# EAGLE design TicTacToe_v3 (EAGLE 9.6.2)

## Sheet 1 of 4
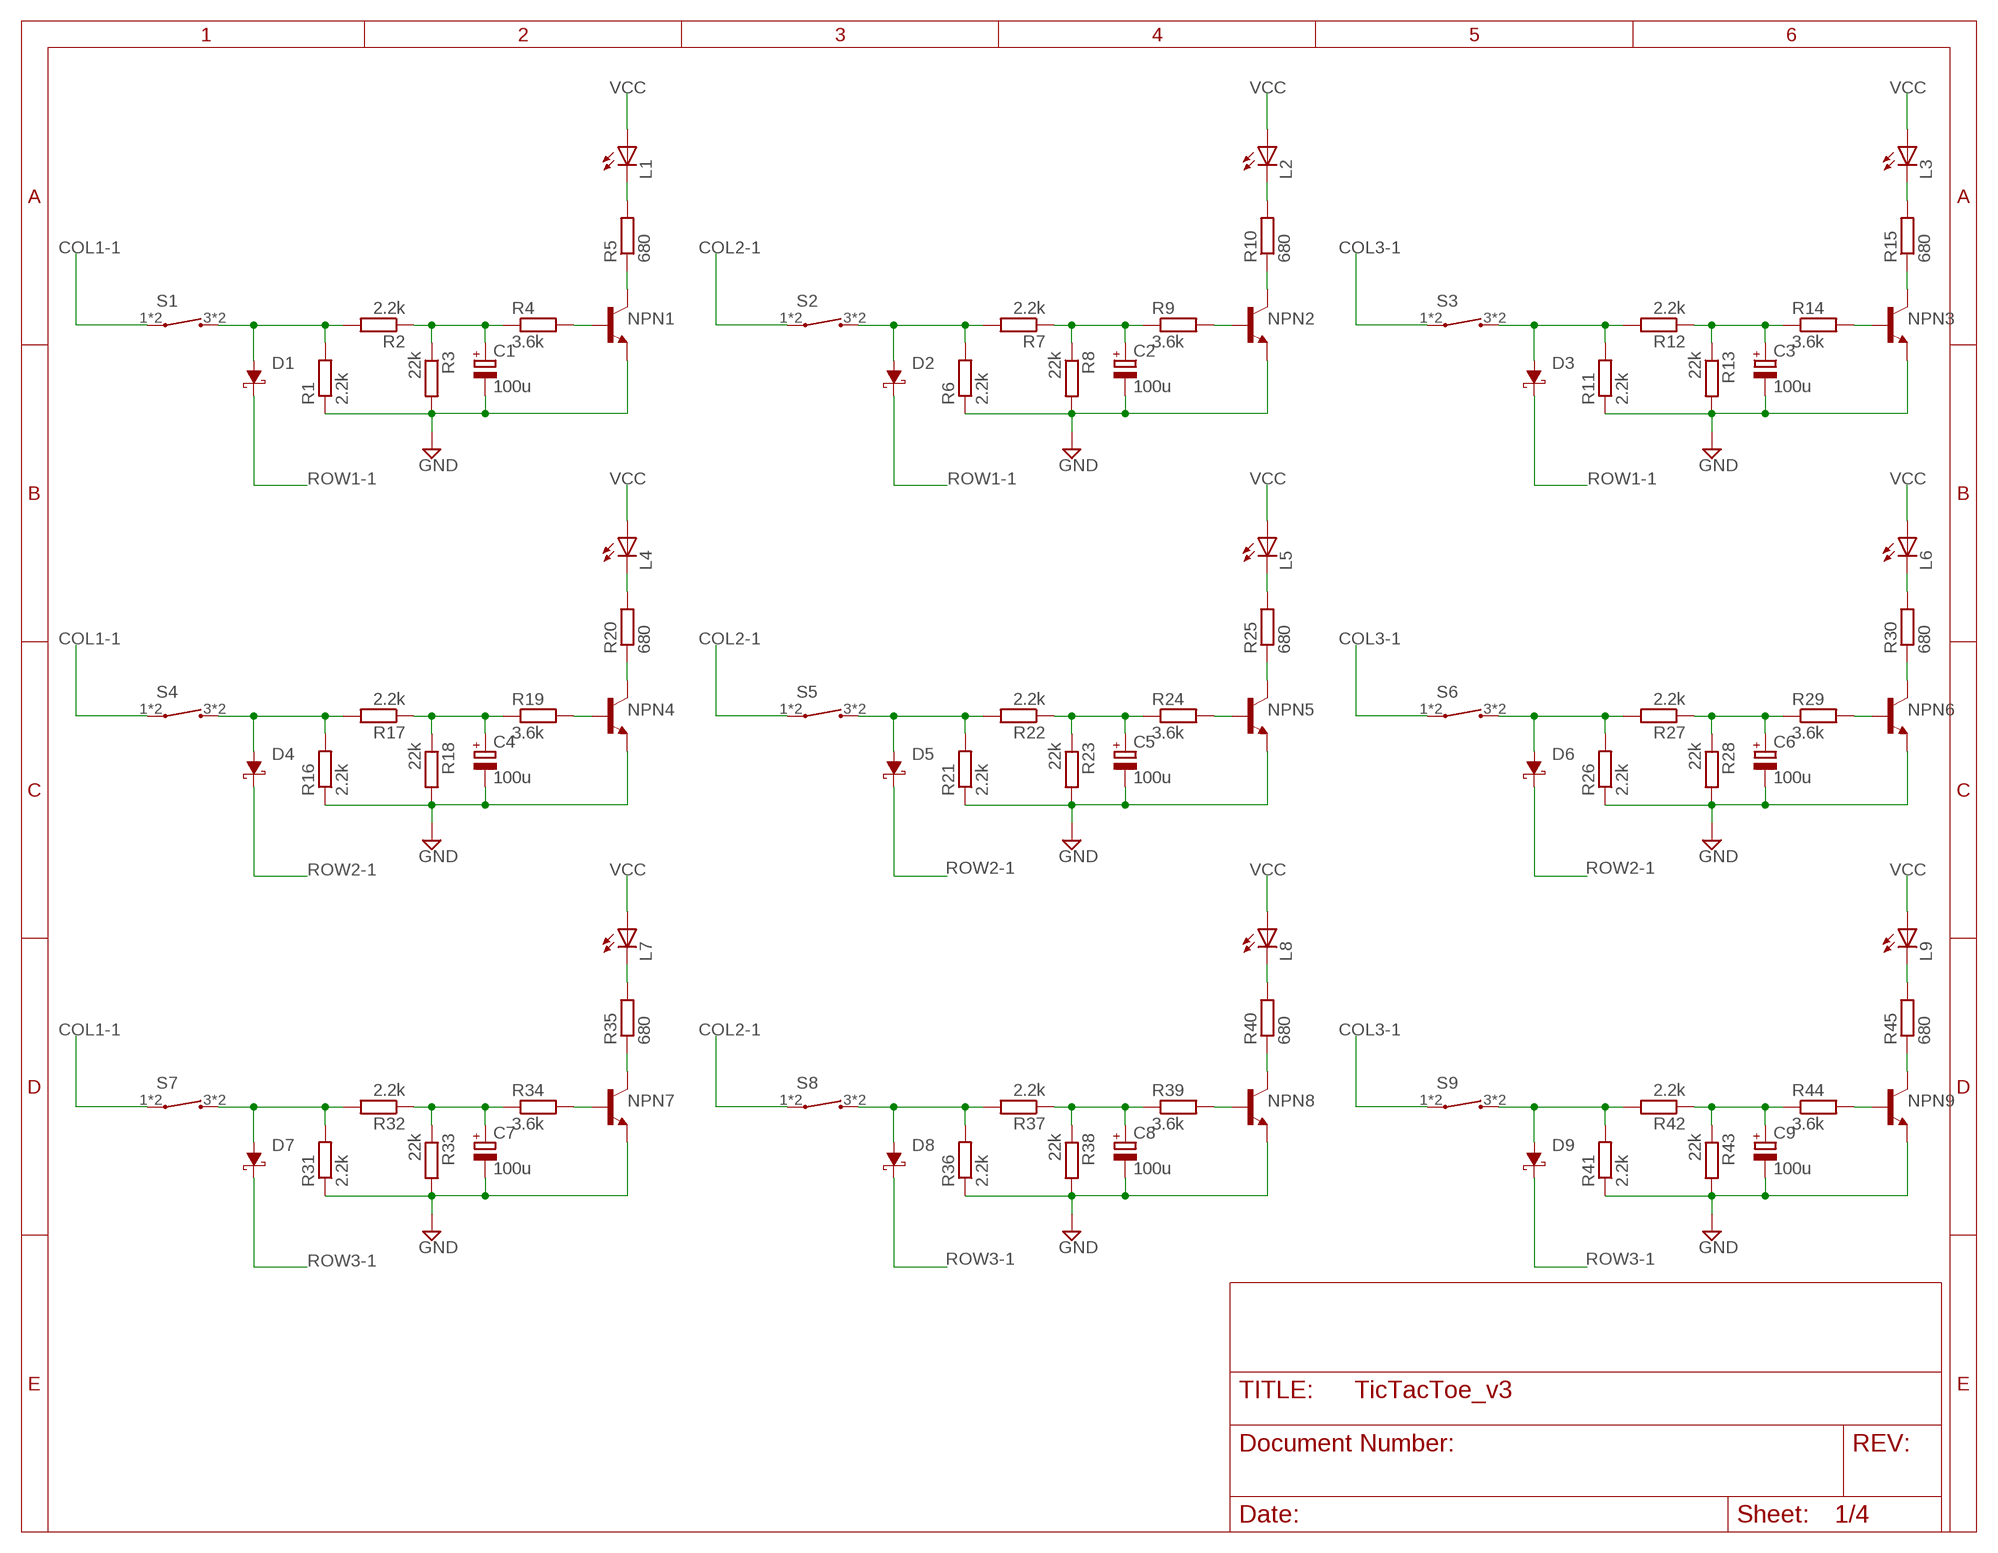
[diagram p0: schematic, sheet 1]

### Parts
C1  100u  T490A  [T490A-COND]
C2  100u  T490A  [T490A-COND]
C3  100u  T490A  [T490A-COND]
C4  100u  T490A  [T490A-COND]
C5  100u  T490A  [T490A-COND]
C6  100u  T490A  [T490A-COND]
C7  100u  T490A  [T490A-COND]
C8  100u  T490A  [T490A-COND]
C9  100u  T490A  [T490A-COND]
D1  PMEG3010EH  [PMEG3010EH-SCHOTTKYDIODE]
D2  PMEG3010EH  [PMEG3010EH-SCHOTTKYDIODE]
D3  PMEG3010EH  [PMEG3010EH-SCHOTTKYDIODE]
D4  PMEG3010EH  [PMEG3010EH-SCHOTTKYDIODE]
D5  PMEG3010EH  [PMEG3010EH-SCHOTTKYDIODE]
D6  PMEG3010EH  [PMEG3010EH-SCHOTTKYDIODE]
D7  PMEG3010EH  [PMEG3010EH-SCHOTTKYDIODE]
D8  PMEG3010EH  [PMEG3010EH-SCHOTTKYDIODE]
D9  PMEG3010EH  [PMEG3010EH-SCHOTTKYDIODE]
L1  150060BS75003  [WL-SMCW-LED(BLUE)]
L2  150060BS75003  [WL-SMCW-LED(BLUE)]
L3  150060BS75003  [WL-SMCW-LED(BLUE)]
L4  150060BS75003  [WL-SMCW-LED(BLUE)]
L5  150060BS75003  [WL-SMCW-LED(BLUE)]
L6  150060BS75003  [WL-SMCW-LED(BLUE)]
L7  150060BS75003  [WL-SMCW-LED(BLUE)]
L8  150060BS75003  [WL-SMCW-LED(BLUE)]
L9  150060BS75003  [WL-SMCW-LED(BLUE)]
NPN1  BC848  [BC848-NPN]
NPN2  BC848  [BC848-NPN]
NPN3  BC848  [BC848-NPN]
NPN4  BC848  [BC848-NPN]
NPN5  BC848  [BC848-NPN]
NPN6  BC848  [BC848-NPN]
NPN7  BC848  [BC848-NPN]
NPN8  BC848  [BC848-NPN]
NPN9  BC848  [BC848-NPN]
R1  2.2k  R-EU_R0603  [R0603]
R2  2.2k  R-EU_R0603  [R0603]
R3  22k  R-EU_R0603  [R0603]
R4  3.6k  R-EU_R0603  [R0603]
R5  680  R-EU_R0603  [R0603]
R6  2.2k  R-EU_R0603  [R0603]
R7  2.2k  R-EU_R0603  [R0603]
R8  22k  R-EU_R0603  [R0603]
R9  3.6k  R-EU_R0603  [R0603]
R10  680  R-EU_R0603  [R0603]
R11  2.2k  R-EU_R0603  [R0603]
R12  2.2k  R-EU_R0603  [R0603]
R13  22k  R-EU_R0603  [R0603]
R14  3.6k  R-EU_R0603  [R0603]
R15  680  R-EU_R0603  [R0603]
R16  2.2k  R-EU_R0603  [R0603]
R17  2.2k  R-EU_R0603  [R0603]
R18  22k  R-EU_R0603  [R0603]
R19  3.6k  R-EU_R0603  [R0603]
R20  680  R-EU_R0603  [R0603]
R21  2.2k  R-EU_R0603  [R0603]
R22  2.2k  R-EU_R0603  [R0603]
R23  22k  R-EU_R0603  [R0603]
R24  3.6k  R-EU_R0603  [R0603]
R25  680  R-EU_R0603  [R0603]
R26  2.2k  R-EU_R0603  [R0603]
R27  2.2k  R-EU_R0603  [R0603]
R28  22k  R-EU_R0603  [R0603]
R29  3.6k  R-EU_R0603  [R0603]
R30  680  R-EU_R0603  [R0603]
R31  2.2k  R-EU_R0603  [R0603]
R32  2.2k  R-EU_R0603  [R0603]
R33  22k  R-EU_R0603  [R0603]
R34  3.6k  R-EU_R0603  [R0603]
R35  680  R-EU_R0603  [R0603]
R36  2.2k  R-EU_R0603  [R0603]
R37  2.2k  R-EU_R0603  [R0603]
R38  22k  R-EU_R0603  [R0603]
R39  3.6k  R-EU_R0603  [R0603]
R40  680  R-EU_R0603  [R0603]
R41  2.2k  R-EU_R0603  [R0603]
R42  2.2k  R-EU_R0603  [R0603]
R43  22k  R-EU_R0603  [R0603]
R44  3.6k  R-EU_R0603  [R0603]
R45  680  R-EU_R0603  [R0603]
S1  PTS647  [PTS647-TACTSWITCH]
S2  PTS647  [PTS647-TACTSWITCH]
S3  PTS647  [PTS647-TACTSWITCH]
S4  PTS647  [PTS647-TACTSWITCH]
S5  PTS647  [PTS647-TACTSWITCH]
S6  PTS647  [PTS647-TACTSWITCH]
S7  PTS647  [PTS647-TACTSWITCH]
S8  PTS647  [PTS647-TACTSWITCH]
S9  PTS647  [PTS647-TACTSWITCH]

### Nets
COL1-1: S1.1 S1.2 S4.1 S4.2 S7.1 S7.2 ; also sheet 4
COL2-1: S2.1 S2.2 S5.1 S5.2 S8.1 S8.2 ; also sheet 4
COL3-1: S3.1 S3.2 S6.1 S6.2 S9.1 S9.2 ; also sheet 4
GND: C1.2(-) C2.2(-) C3.2(-) C4.2(-) C5.2(-) C6.2(-) C7.2(-) C8.2(-) C9.2(-) NPN1.2(E) NPN2.2(E) NPN3.2(E) NPN4.2(E) NPN5.2(E) NPN6.2(E) NPN7.2(E) NPN8.2(E) NPN9.2(E) R1.1 R3.2 R6.1 R8.2 R11.1 R13.2 R16.1 R18.2 R21.1 R23.2 R26.1 R28.2 R31.1 R33.2 R36.1 R38.2 R41.1 R43.2 ; also sheet 2,4
N$1: D1.2(A) R1.2 R2.2 S1.3 S1.4
N$2: C1.1(+) R2.1 R3.1 R4.1
N$3: NPN1.1(B) R4.2
N$4: D2.2(A) R6.2 R7.2 S2.3 S2.4
N$5: C2.1(+) R7.1 R8.1 R9.1
N$6: NPN1.3(C) R5.1
N$7: L1.1(C) R5.2
N$8: NPN2.1(B) R9.2
N$9: D4.2(A) R16.2 R17.2 S4.3 S4.4
N$10: NPN2.3(C) R10.1
N$11: L2.1(C) R10.2
N$12: C4.1(+) R17.1 R18.1 R19.1
N$13: D3.2(A) R11.2 R12.2 S3.3 S3.4
N$14: C3.1(+) R12.1 R13.1 R14.1
N$15: NPN3.1(B) R14.2
N$16: NPN3.3(C) R15.1
N$17: L3.1(C) R15.2
N$18: NPN4.1(B) R19.2
N$19: NPN4.3(C) R20.1
N$20: L4.1(C) R20.2
N$21: D5.2(A) R21.2 R22.2 S5.3 S5.4
N$22: C5.1(+) R22.1 R23.1 R24.1
N$23: NPN5.1(B) R24.2
N$24: NPN5.3(C) R25.1
N$25: L5.1(C) R25.2
N$26: D6.2(A) R26.2 R27.2 S6.3 S6.4
N$27: C6.1(+) R27.1 R28.1 R29.1
N$28: NPN6.1(B) R29.2
N$29: NPN6.3(C) R30.1
N$30: L6.1(C) R30.2
N$31: D7.2(A) R31.2 R32.2 S7.3 S7.4
N$32: C7.1(+) R32.1 R33.1 R34.1
N$33: NPN7.1(B) R34.2
N$34: NPN7.3(C) R35.1
N$35: L7.1(C) R35.2
N$36: D8.2(A) R36.2 R37.2 S8.3 S8.4
N$37: C8.1(+) R37.1 R38.1 R39.1
N$38: NPN8.1(B) R39.2
N$39: NPN8.3(C) R40.1
N$40: L8.1(C) R40.2
N$41: D9.2(A) R41.2 R42.2 S9.3 S9.4
N$42: C9.1(+) R42.1 R43.1 R44.1
N$43: NPN9.1(B) R44.2
N$44: NPN9.3(C) R45.1
N$45: L9.1(C) R45.2
ROW1-1: D1.1(C) D2.1(C) D3.1(C) ; also sheet 4
ROW2-1: D4.1(C) D5.1(C) D6.1(C) ; also sheet 4
ROW3-1: D7.1(C) D8.1(C) D9.1(C) ; also sheet 4
VCC: L1.2(A) L2.2(A) L3.2(A) L4.2(A) L5.2(A) L6.2(A) L7.2(A) L8.2(A) L9.2(A) ; also sheet 2,4

## Sheet 2 of 4
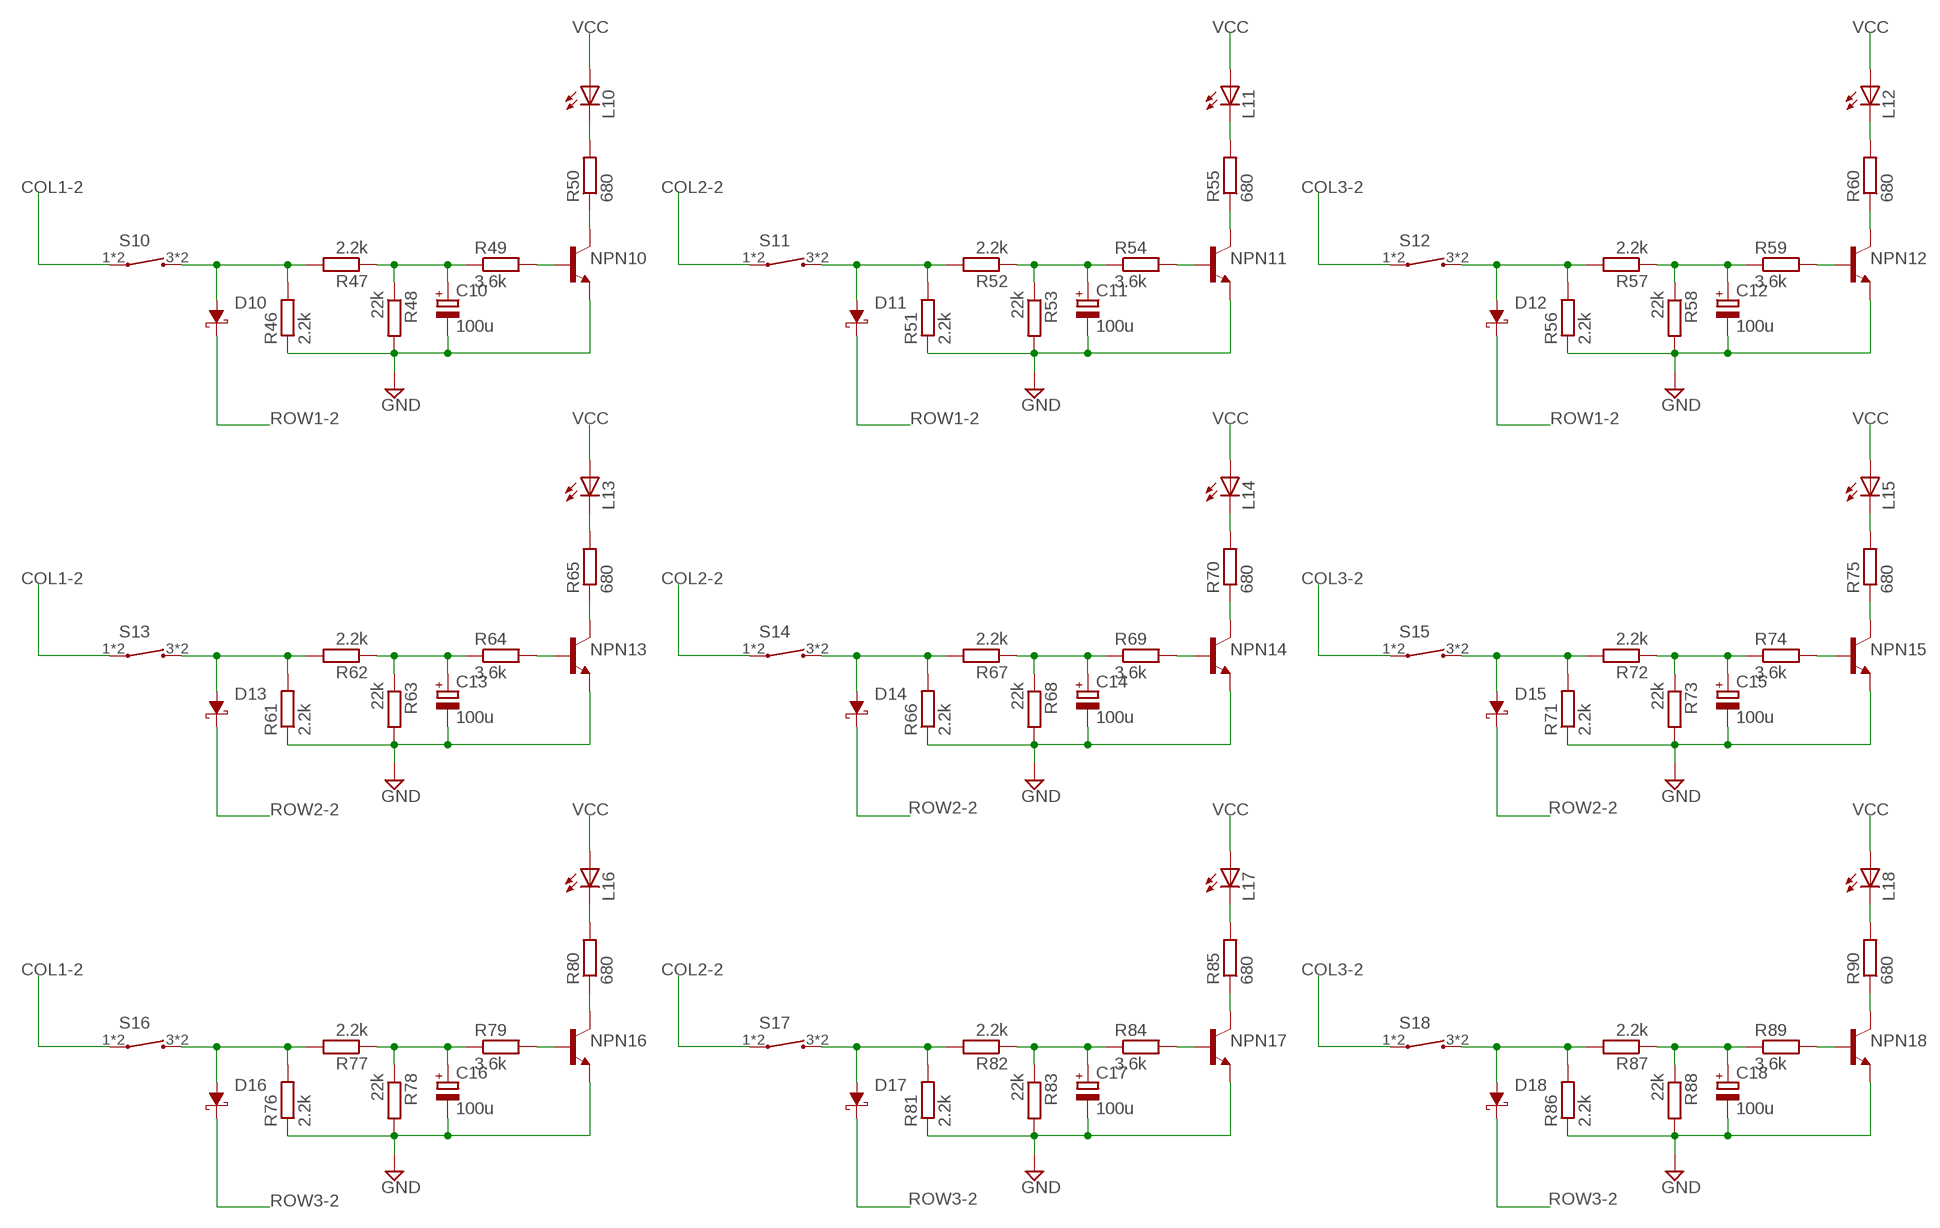
[diagram p1: schematic, sheet 2]

### Parts
C10  100u  T490A  [T490A-COND]
C11  100u  T490A  [T490A-COND]
C12  100u  T490A  [T490A-COND]
C13  100u  T490A  [T490A-COND]
C14  100u  T490A  [T490A-COND]
C15  100u  T490A  [T490A-COND]
C16  100u  T490A  [T490A-COND]
C17  100u  T490A  [T490A-COND]
C18  100u  T490A  [T490A-COND]
D10  PMEG3010EH  [PMEG3010EH-SCHOTTKYDIODE]
D11  PMEG3010EH  [PMEG3010EH-SCHOTTKYDIODE]
D12  PMEG3010EH  [PMEG3010EH-SCHOTTKYDIODE]
D13  PMEG3010EH  [PMEG3010EH-SCHOTTKYDIODE]
D14  PMEG3010EH  [PMEG3010EH-SCHOTTKYDIODE]
D15  PMEG3010EH  [PMEG3010EH-SCHOTTKYDIODE]
D16  PMEG3010EH  [PMEG3010EH-SCHOTTKYDIODE]
D17  PMEG3010EH  [PMEG3010EH-SCHOTTKYDIODE]
D18  PMEG3010EH  [PMEG3010EH-SCHOTTKYDIODE]
L10  150060BS75003  [WL-SMCW-LED(BLUE)]
L11  150060BS75003  [WL-SMCW-LED(BLUE)]
L12  150060BS75003  [WL-SMCW-LED(BLUE)]
L13  150060BS75003  [WL-SMCW-LED(BLUE)]
L14  150060BS75003  [WL-SMCW-LED(BLUE)]
L15  150060BS75003  [WL-SMCW-LED(BLUE)]
L16  150060BS75003  [WL-SMCW-LED(BLUE)]
L17  150060BS75003  [WL-SMCW-LED(BLUE)]
L18  150060BS75003  [WL-SMCW-LED(BLUE)]
NPN10  BC848  [BC848-NPN]
NPN11  BC848  [BC848-NPN]
NPN12  BC848  [BC848-NPN]
NPN13  BC848  [BC848-NPN]
NPN14  BC848  [BC848-NPN]
NPN15  BC848  [BC848-NPN]
NPN16  BC848  [BC848-NPN]
NPN17  BC848  [BC848-NPN]
NPN18  BC848  [BC848-NPN]
R46  2.2k  R-EU_R0603  [R0603]
R47  2.2k  R-EU_R0603  [R0603]
R48  22k  R-EU_R0603  [R0603]
R49  3.6k  R-EU_R0603  [R0603]
R50  680  R-EU_R0603  [R0603]
R51  2.2k  R-EU_R0603  [R0603]
R52  2.2k  R-EU_R0603  [R0603]
R53  22k  R-EU_R0603  [R0603]
R54  3.6k  R-EU_R0603  [R0603]
R55  680  R-EU_R0603  [R0603]
R56  2.2k  R-EU_R0603  [R0603]
R57  2.2k  R-EU_R0603  [R0603]
R58  22k  R-EU_R0603  [R0603]
R59  3.6k  R-EU_R0603  [R0603]
R60  680  R-EU_R0603  [R0603]
R61  2.2k  R-EU_R0603  [R0603]
R62  2.2k  R-EU_R0603  [R0603]
R63  22k  R-EU_R0603  [R0603]
R64  3.6k  R-EU_R0603  [R0603]
R65  680  R-EU_R0603  [R0603]
R66  2.2k  R-EU_R0603  [R0603]
R67  2.2k  R-EU_R0603  [R0603]
R68  22k  R-EU_R0603  [R0603]
R69  3.6k  R-EU_R0603  [R0603]
R70  680  R-EU_R0603  [R0603]
R71  2.2k  R-EU_R0603  [R0603]
R72  2.2k  R-EU_R0603  [R0603]
R73  22k  R-EU_R0603  [R0603]
R74  3.6k  R-EU_R0603  [R0603]
R75  680  R-EU_R0603  [R0603]
R76  2.2k  R-EU_R0603  [R0603]
R77  2.2k  R-EU_R0603  [R0603]
R78  22k  R-EU_R0603  [R0603]
R79  3.6k  R-EU_R0603  [R0603]
R80  680  R-EU_R0603  [R0603]
R81  2.2k  R-EU_R0603  [R0603]
R82  2.2k  R-EU_R0603  [R0603]
R83  22k  R-EU_R0603  [R0603]
R84  3.6k  R-EU_R0603  [R0603]
R85  680  R-EU_R0603  [R0603]
R86  2.2k  R-EU_R0603  [R0603]
R87  2.2k  R-EU_R0603  [R0603]
R88  22k  R-EU_R0603  [R0603]
R89  3.6k  R-EU_R0603  [R0603]
R90  680  R-EU_R0603  [R0603]
S10  PTS647  [PTS647-TACTSWITCH]
S11  PTS647  [PTS647-TACTSWITCH]
S12  PTS647  [PTS647-TACTSWITCH]
S13  PTS647  [PTS647-TACTSWITCH]
S14  PTS647  [PTS647-TACTSWITCH]
S15  PTS647  [PTS647-TACTSWITCH]
S16  PTS647  [PTS647-TACTSWITCH]
S17  PTS647  [PTS647-TACTSWITCH]
S18  PTS647  [PTS647-TACTSWITCH]

### Nets
COL1-2: S10.1 S10.2 S13.1 S13.2 S16.1 S16.2 ; also sheet 4
COL2-2: S11.1 S11.2 S14.1 S14.2 S17.1 S17.2 ; also sheet 4
COL3-2: S12.1 S12.2 S15.1 S15.2 S18.1 S18.2 ; also sheet 4
GND: C10.2(-) C11.2(-) C12.2(-) C13.2(-) C14.2(-) C15.2(-) C16.2(-) C17.2(-) C18.2(-) NPN10.2(E) NPN11.2(E) NPN12.2(E) NPN13.2(E) NPN14.2(E) NPN15.2(E) NPN16.2(E) NPN17.2(E) NPN18.2(E) R46.1 R48.2 R51.1 R53.2 R56.1 R58.2 R61.1 R63.2 R66.1 R68.2 R71.1 R73.2 R76.1 R78.2 R81.1 R83.2 R86.1 R88.2 ; also sheet 1,4
N$46: D10.2(A) R46.2 R47.2 S10.3 S10.4
N$47: C10.1(+) R47.1 R48.1 R49.1
N$48: NPN10.1(B) R49.2
N$49: NPN10.3(C) R50.1
N$50: L10.1(C) R50.2
N$51: D11.2(A) R51.2 R52.2 S11.3 S11.4
N$52: C11.1(+) R52.1 R53.1 R54.1
N$53: NPN11.1(B) R54.2
N$54: NPN11.3(C) R55.1
N$55: L11.1(C) R55.2
N$56: D12.2(A) R56.2 R57.2 S12.3 S12.4
N$57: C12.1(+) R57.1 R58.1 R59.1
N$58: NPN12.1(B) R59.2
N$59: NPN12.3(C) R60.1
N$60: L12.1(C) R60.2
N$61: D13.2(A) R61.2 R62.2 S13.3 S13.4
N$62: C13.1(+) R62.1 R63.1 R64.1
N$63: NPN13.1(B) R64.2
N$64: NPN13.3(C) R65.1
N$65: L13.1(C) R65.2
N$66: D14.2(A) R66.2 R67.2 S14.3 S14.4
N$67: C14.1(+) R67.1 R68.1 R69.1
N$68: NPN14.1(B) R69.2
N$69: NPN14.3(C) R70.1
N$70: L14.1(C) R70.2
N$71: D15.2(A) R71.2 R72.2 S15.3 S15.4
N$72: C15.1(+) R72.1 R73.1 R74.1
N$73: NPN15.1(B) R74.2
N$74: NPN15.3(C) R75.1
N$75: L15.1(C) R75.2
N$76: D16.2(A) R76.2 R77.2 S16.3 S16.4
N$77: C16.1(+) R77.1 R78.1 R79.1
N$78: NPN16.1(B) R79.2
N$79: NPN16.3(C) R80.1
N$80: L16.1(C) R80.2
N$81: D17.2(A) R81.2 R82.2 S17.3 S17.4
N$82: C17.1(+) R82.1 R83.1 R84.1
N$83: NPN17.1(B) R84.2
N$84: NPN17.3(C) R85.1
N$85: L17.1(C) R85.2
N$86: D18.2(A) R86.2 R87.2 S18.3 S18.4
N$87: C18.1(+) R87.1 R88.1 R89.1
N$88: NPN18.1(B) R89.2
N$89: NPN18.3(C) R90.1
N$90: L18.1(C) R90.2
ROW1-2: D10.1(C) D11.1(C) D12.1(C) ; also sheet 4
ROW2-2: D13.1(C) D14.1(C) D15.1(C) ; also sheet 4
ROW3-2: D16.1(C) D17.1(C) D18.1(C) ; also sheet 4
VCC: L10.2(A) L11.2(A) L12.2(A) L13.2(A) L14.2(A) L15.2(A) L16.2(A) L17.2(A) L18.2(A) ; also sheet 1,4

## Sheet 3 of 4
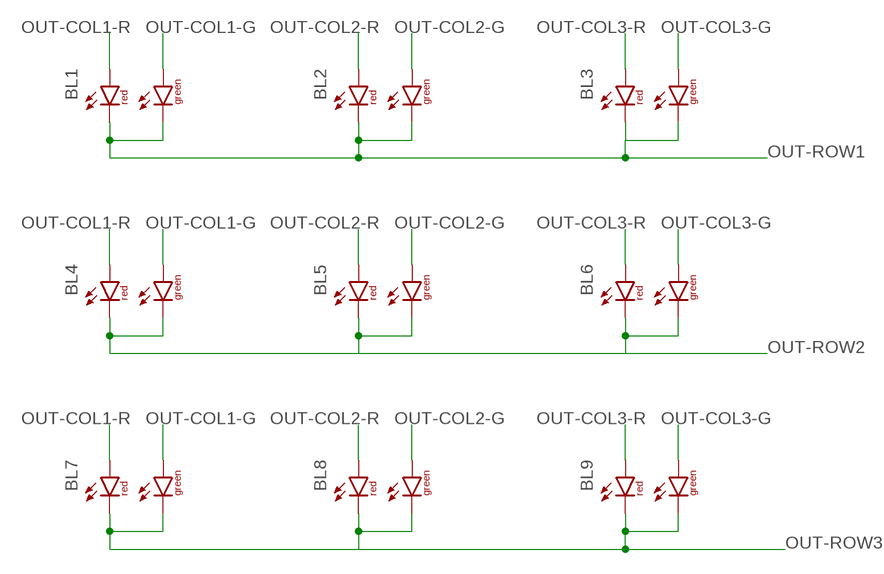
[diagram p2: schematic, sheet 3]

### Parts
BL1  APHBM2012ETSGT(R/G)  [APHBM2012ETSGTC-BICOLORLED(R/G)]
BL2  APHBM2012ETSGT(R/G)  [APHBM2012ETSGTC-BICOLORLED(R/G)]
BL3  APHBM2012ETSGT(R/G)  [APHBM2012ETSGTC-BICOLORLED(R/G)]
BL4  APHBM2012ETSGT(R/G)  [APHBM2012ETSGTC-BICOLORLED(R/G)]
BL5  APHBM2012ETSGT(R/G)  [APHBM2012ETSGTC-BICOLORLED(R/G)]
BL6  APHBM2012ETSGT(R/G)  [APHBM2012ETSGTC-BICOLORLED(R/G)]
BL7  APHBM2012ETSGT(R/G)  [APHBM2012ETSGTC-BICOLORLED(R/G)]
BL8  APHBM2012ETSGT(R/G)  [APHBM2012ETSGTC-BICOLORLED(R/G)]
BL9  APHBM2012ETSGT(R/G)  [APHBM2012ETSGTC-BICOLORLED(R/G)]

### Nets
OUT-COL1-G: BL1.4(AG) BL4.4(AG) BL7.4(AG) ; also sheet 4
OUT-COL1-R: BL1.1(AR) BL4.1(AR) BL7.1(AR) ; also sheet 4
OUT-COL2-G: BL2.4(AG) BL5.4(AG) BL8.4(AG) ; also sheet 4
OUT-COL2-R: BL2.1(AR) BL5.1(AR) BL8.1(AR) ; also sheet 4
OUT-COL3-G: BL3.4(AG) BL6.4(AG) BL9.4(AG) ; also sheet 4
OUT-COL3-R: BL3.1(AR) BL6.1(AR) BL9.1(AR) ; also sheet 4
OUT-ROW1: BL1.2(CR) BL1.3(CG) BL2.2(CR) BL2.3(CG) BL3.2(CR) BL3.3(CG) ; also sheet 4
OUT-ROW2: BL4.2(CR) BL4.3(CG) BL5.2(CR) BL5.3(CG) BL6.2(CR) BL6.3(CG) ; also sheet 4
OUT-ROW3: BL7.2(CR) BL7.3(CG) BL8.2(CR) BL8.3(CG) BL9.2(CR) BL9.3(CG) ; also sheet 4

## Sheet 4 of 4
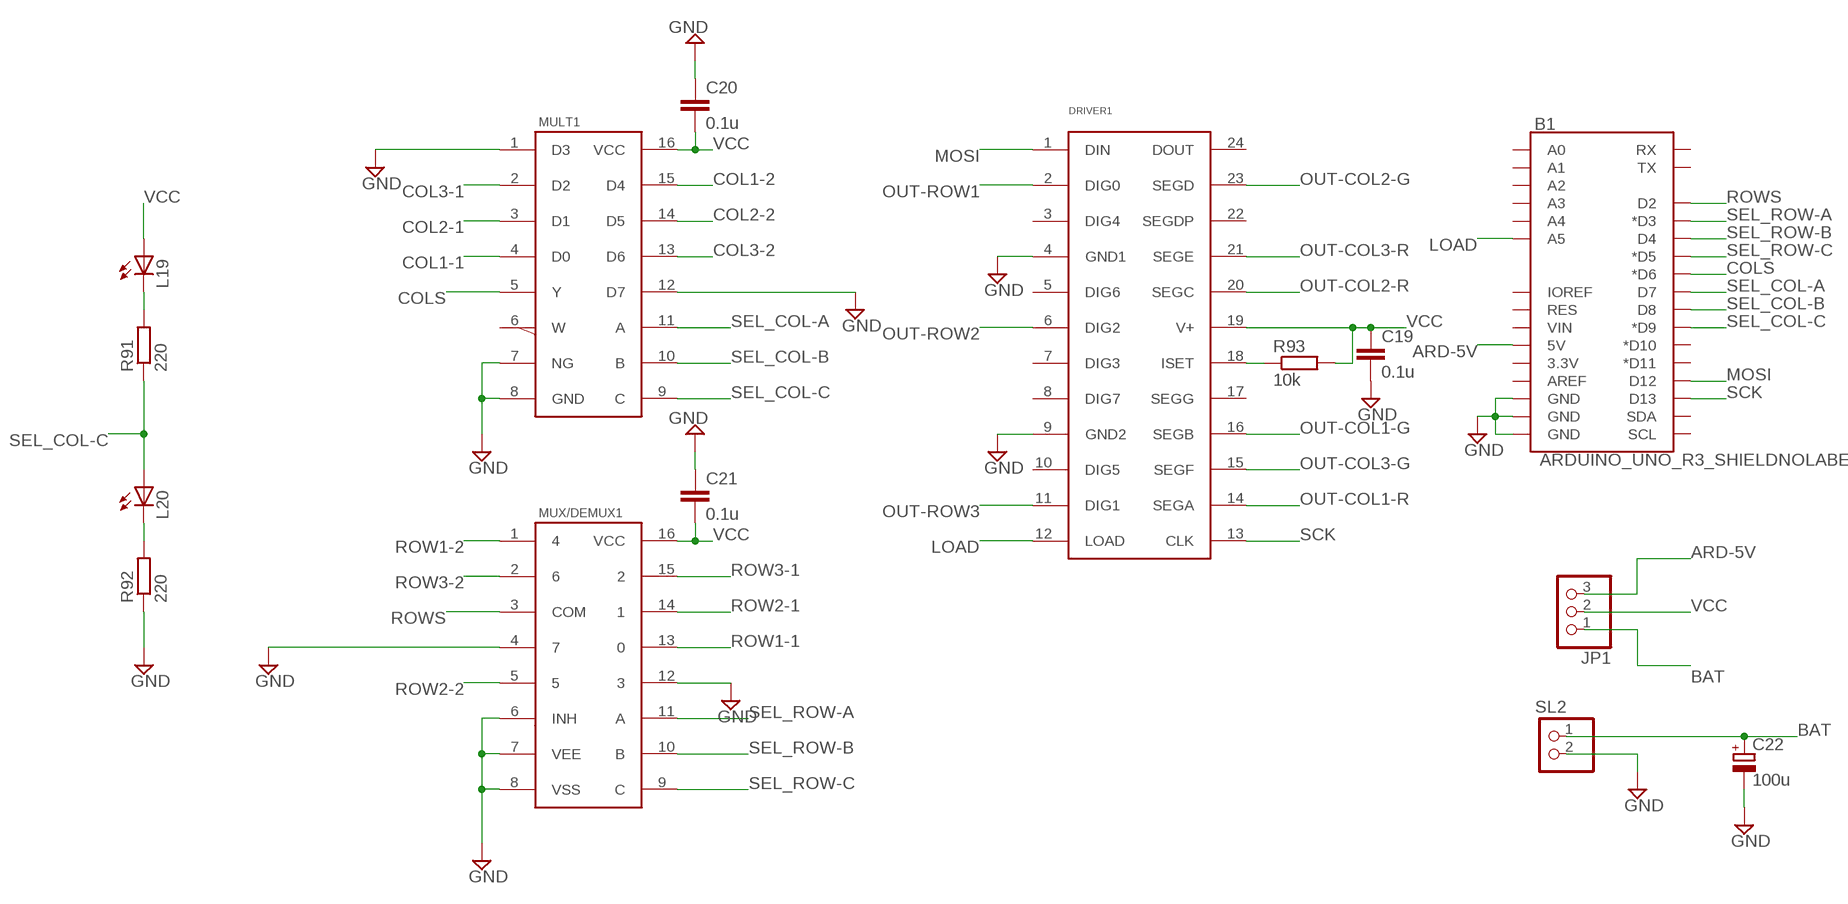
[diagram p3: schematic, sheet 4]

### Parts
B1  ARDUINO_UNO_R3_SHIELDNOLABELS  [UNO_R3_SHIELD_NOLABELS]
C19  0.1u  C-EUC0603  [C0603]
C20  0.1u  C-EUC0603  [C0603]
C21  0.1u  C-EUC0603  [C0603]
C22  100u  T490A  [T490A-COND]
DRIVER1  MAX7219  [MAX7219EWGT]
JP1  PINHD-1X3  [1X03]
L19  150060BS75003  [WL-SMCW-LED(BLUE)]
L20  150060BS75003  [WL-SMCW-LED(BLUE)]
MULT1  SN74F151BDR  [SOIC16N]
MUX/DEMUX1  TC4051B  [SOIC16N]
R91  220  R-EU_R0603  [R0603]
R92  220  R-EU_R0603  [R0603]
R93  10k  R-EU_R0603  [R0603]
SL2  PINHD-1X2  [1X02]

### Nets
ARD-5V: B1.5V JP1.3
BAT: C22.1(+) JP1.1 SL2.1
COL1-1: MULT1.4(D0) ; also sheet 1
COL1-2: MULT1.15(D4) ; also sheet 2
COL2-1: MULT1.3(D1) ; also sheet 1
COL2-2: MULT1.14(D5) ; also sheet 2
COL3-1: MULT1.2(D2) ; also sheet 1
COL3-2: MULT1.13(D6) ; also sheet 2
COLS: B1.D6(*D6) MULT1.5(Y)
GND: B1.GND@0(GND) B1.GND@1(GND) B1.GND@2(GND) C19.2 C20.1 C21.1 C22.2(-) DRIVER1.4(GND1) DRIVER1.9(GND2) MULT1.1(D3) MULT1.7(NG) MULT1.8(GND) MULT1.12(D7) MUX/DEMUX1.4 MUX/DEMUX1.6(INH) MUX/DEMUX1.7(VEE) MUX/DEMUX1.8(VSS) MUX/DEMUX1.12 R92.1 SL2.2 ; also sheet 1,2
LOAD: B1.A5 DRIVER1.12(LOAD)
MOSI: B1.D12 DRIVER1.1(DIN)
N$91: DRIVER1.18(ISET) R93.1
N$92: L19.1(C) R91.2
N$94: L20.1(C) R92.2
OUT-COL1-G: DRIVER1.16(SEGB) ; also sheet 3
OUT-COL1-R: DRIVER1.14(SEGA) ; also sheet 3
OUT-COL2-G: DRIVER1.23(SEGD) ; also sheet 3
OUT-COL2-R: DRIVER1.20(SEGC) ; also sheet 3
OUT-COL3-G: DRIVER1.15(SEGF) ; also sheet 3
OUT-COL3-R: DRIVER1.21(SEGE) ; also sheet 3
OUT-ROW1: DRIVER1.2(DIG0) ; also sheet 3
OUT-ROW2: DRIVER1.6(DIG2) ; also sheet 3
OUT-ROW3: DRIVER1.11(DIG1) ; also sheet 3
ROW1-1: MUX/DEMUX1.13 ; also sheet 1
ROW1-2: MUX/DEMUX1.1 ; also sheet 2
ROW2-1: MUX/DEMUX1.14 ; also sheet 1
ROW2-2: MUX/DEMUX1.5 ; also sheet 2
ROW3-1: MUX/DEMUX1.15 ; also sheet 1
ROW3-2: MUX/DEMUX1.2 ; also sheet 2
ROWS: B1.D2 MUX/DEMUX1.3(COM)
SCK: B1.D13 DRIVER1.13(CLK)
SEL_COL-A: B1.D7 MULT1.11(A)
SEL_COL-B: B1.D8 MULT1.10(B)
SEL_COL-C: B1.D9(*D9) L20.2(A) MULT1.9(C) R91.1
SEL_ROW-A: B1.D3(*D3) MUX/DEMUX1.11(A)
SEL_ROW-B: B1.D4 MUX/DEMUX1.10(B)
SEL_ROW-C: B1.D5(*D5) MUX/DEMUX1.9(C)
VCC: C19.1 C20.2 C21.2 DRIVER1.19(V+) JP1.2 L19.2(A) MULT1.16(VCC) MUX/DEMUX1.16(VCC) R93.2 ; also sheet 1,2
Unconnected: B1.3.3V B1.A0 B1.A1 B1.A2 B1.A3 B1.A4 B1.AREF B1.D10(*D10) B1.D11(*D11) B1.IOREF B1.RES B1.RX B1.SCL B1.SDA B1.TX B1.VIN DRIVER1.3(DIG4) DRIVER1.5(DIG6) DRIVER1.7(DIG3) DRIVER1.8(DIG7) DRIVER1.10(DIG5) DRIVER1.17(SEGG) DRIVER1.22(SEGDP) DRIVER1.24(DOUT) MULT1.6(W)

## Library data of the parts
B1 = SparkFun-Boards:ARDUINO_UNO_R3_SHIELD: Arduino R3 Shield Footprint Shield form compatible with the Arduino Uno R3. SparkFun Products: MG2639 Cellular Shield <https://www.sparkfun.com/products/13120> MIDI Shield <https://www.sparkfun.com/products/12898> R3 Stackable Headers Kit <https://www.sparkfun.com/products/11417>
BL1-BL9 = Tic-Tac-Toe_Component:APHBM2012ETSGT(R/G)
C1-C18 C22 = Tic-Tac-Toe_Component:T490A
C19-C21 = rcl:C-EU: CAPACITOR, European symbol; SPICEPREFIX: C
D1-D18 = Tic-Tac-Toe_Component:PMEG3010EH
DRIVER1 = Tic-Tac-Toe_Component:MAX7219
JP1 = pinhead:PINHD-1X3: PIN HEADER
L1-L20 = Tic-Tac-Toe_Component:150060BS75003
MULT1 = Tic-Tac-Toe_Component:SN74F151BDR
MUX/DEMUX1 = Tic-Tac-Toe_Component:TC4051B
NPN1-NPN18 = Tic-Tac-Toe_Component:BC848
R1-R93 = rcl:R-EU_: RESISTOR, European symbol; SPICEPREFIX: R
S1-S18 = Tic-Tac-Toe_Component:PTS647: Four terminal ON/OFF mechanical tactil switch Supporting Material: PTS647 Datasheet <https://www.mouser.de/datasheet/2/60/pts647-1841803.pdf>
SL2 = pinhead:PINHD-1X2: PIN HEADER

## Net classes
0 default: clearance 0.2 mm

## Board
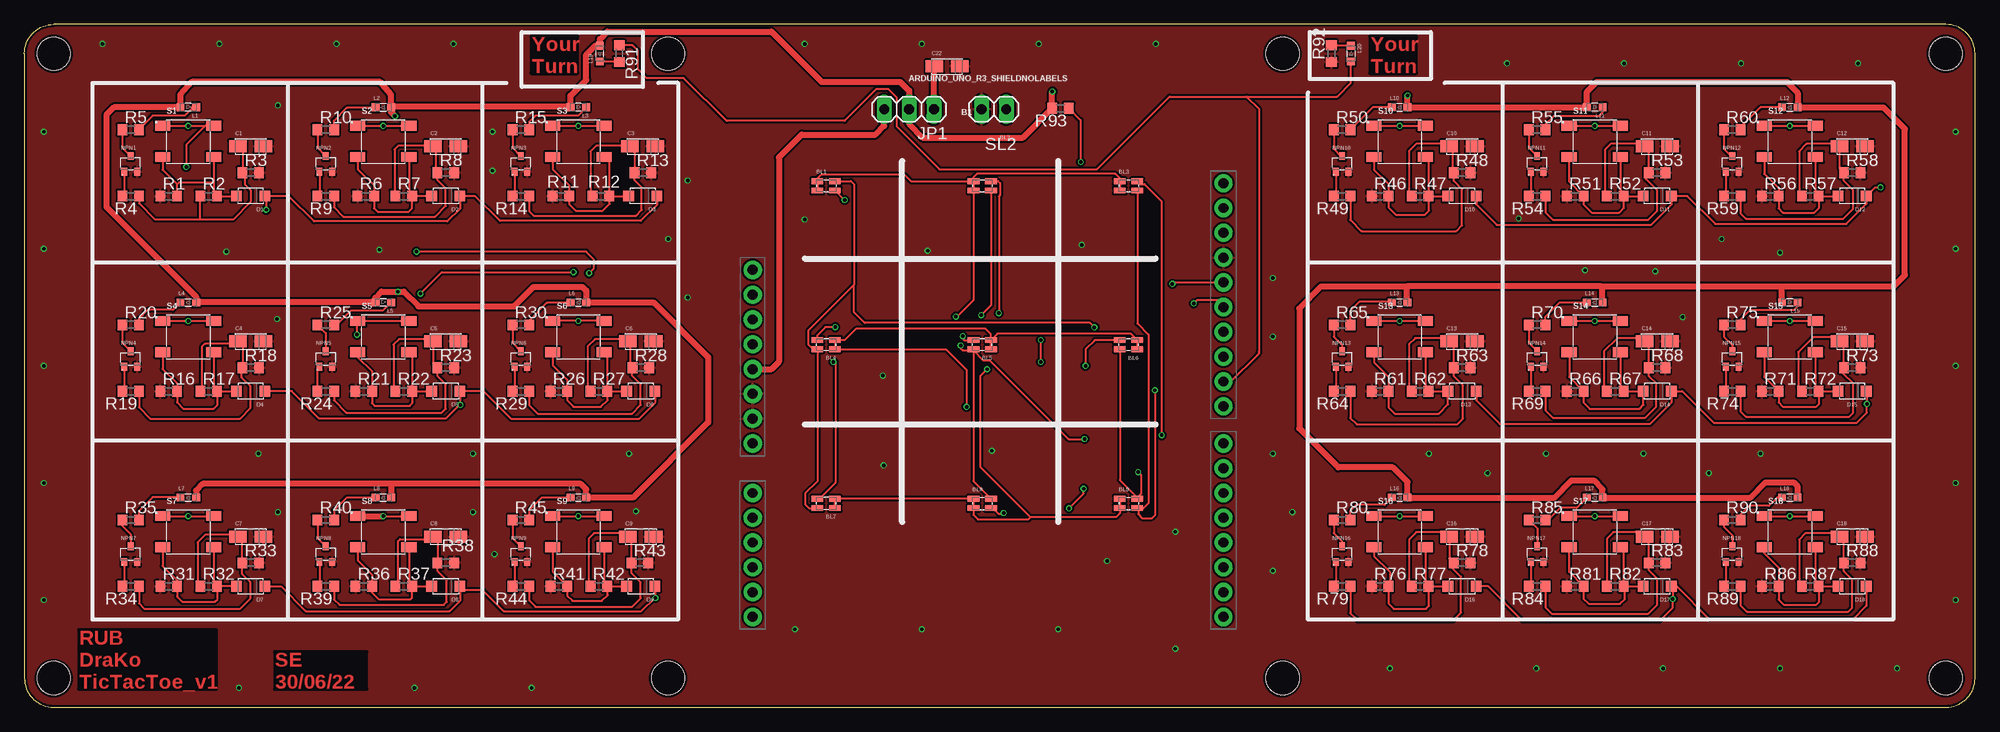
[diagram p4: board, top side]
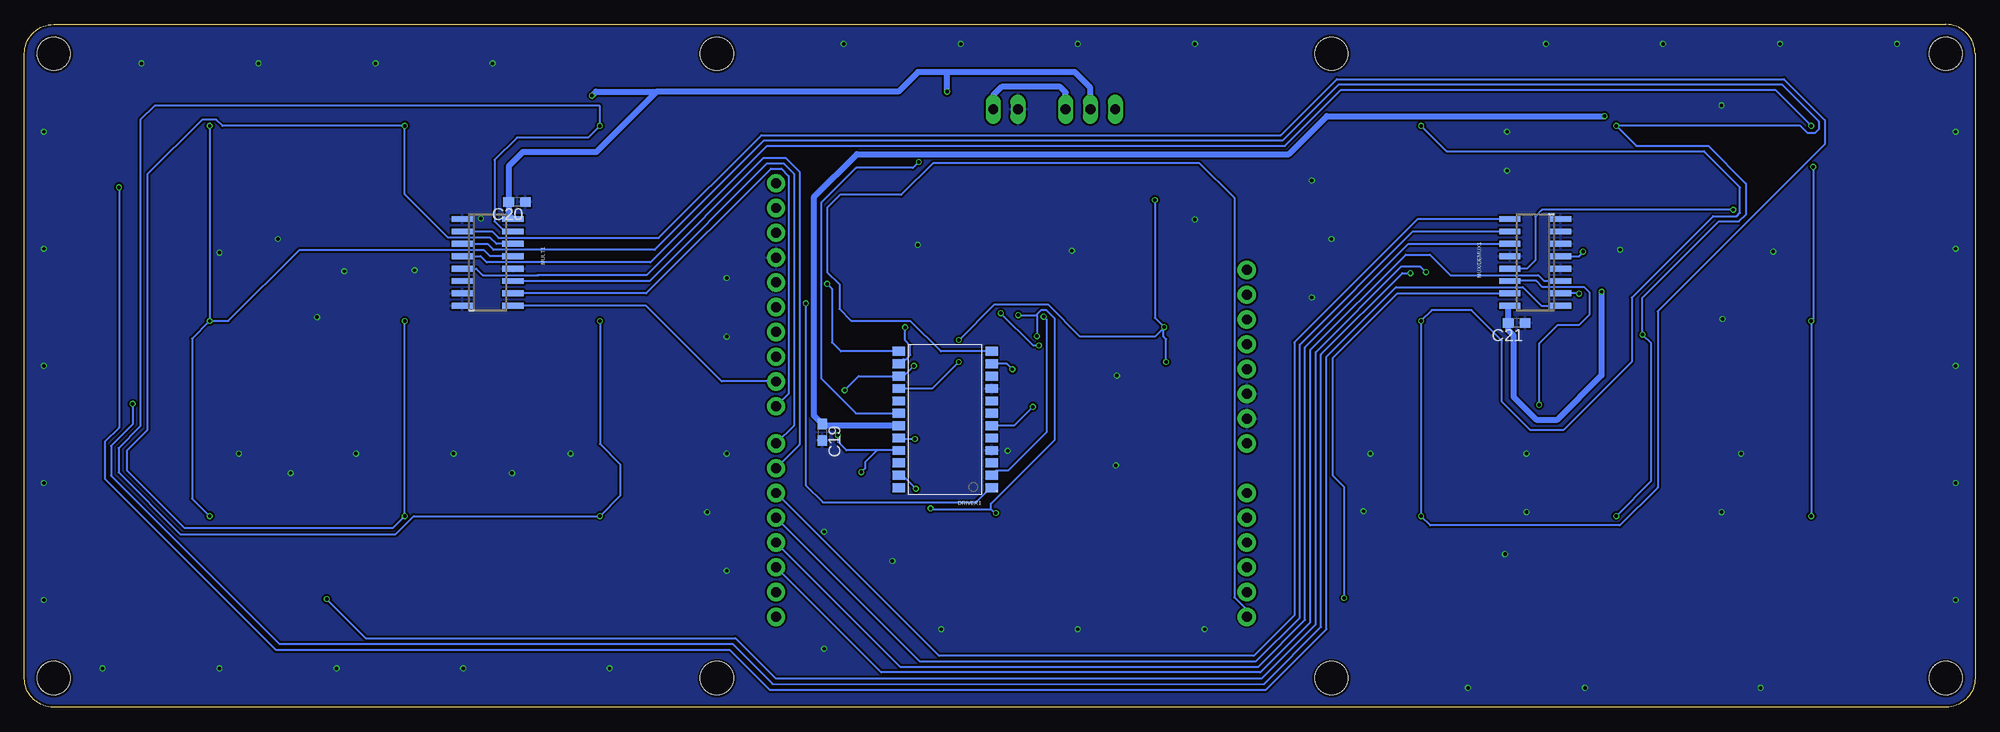
[diagram p5: board, bottom side, seen from below]

Size 200 x 70 mm. Coordinates in mm from the lower left corner, seen from the top.
Outline: 3,0 197,0 arc90 200,3 200,67 arc90 197,70 3,70 arc90 0,67 0,3 arc90 3,0
Copper layers (1*16): Top 0.018mm / dielectric 1.55mm / Bottom 0.018mm
Design rules "eC_2Layer_PClass6_BaseCopperO18_eCDefault": minimum track width 0.15mm, minimum drill 0.35mm, track to track 0.15mm, track to pad 0.15mm, pad to pad 0.15mm, via to via 0.15mm, smd to smd 0mil, copper to edge 0.25mm, drill to drill 0.35mm, minimum pad ring 0.175mm, minimum via ring 0.125mm, stop-mask expansion 0mil, vias tented up to drill 0.45mm, thermal gap 0.2mm
Holes 3.4 mm at 3,67 3,3 197,67 197,3 66,67 66,3 129,67 129,3

### Footprints (pad centres in the part's own frame; a part is rotated, then mirrored left to right if it is on the bottom)
UNO_R3_SHIELD_NOLABELS = drill 1.016 pad 1.88: 3.3V 24.13,-3.81; 5V 24.13,-1.27; A0 24.13,11.43; A1 24.13,13.97; A2 24.13,16.51; A3 24.13,19.05; A4 24.13,21.59; A5 24.13,24.13; AREF -24.13,-15.24; D2 -24.13,19.05; D3 -24.13,16.51; D4 -24.13,13.97; D5 -24.13,11.43; D6 -24.13,8.89; D7 -24.13,6.35; D8 -24.13,2.54; D9 -24.13,0; D10 -24.13,-2.54; D11 -24.13,-5.08; D12 -24.13,-7.62; D13 -24.13,-10.16; GND@0 24.13,1.27; GND@1 24.13,3.81; GND@2 -24.13,-12.7; IOREF 24.13,-8.89; NC 24.13,-11.43; RES 24.13,-6.35; RX -24.13,24.13; SCL -24.13,-20.32; SDA -24.13,-17.78; TX -24.13,21.59; VIN 24.13,6.35
APHBM2012ETSGTC-BICOLORLED(R/G) = smd 1.2 x 0.6: 1 0.9,0.475; 2 -0.9,0.475; 3 -0.9,-0.475; 4 0.9,-0.475
T490A-COND = smd 1.8 x 1.23: 1 -1.31,0; 2 1.31,0
C0603 = smd 1.1 x 1: 1 -0.85,0; 2 0.85,0
PMEG3010EH-SCHOTTKYDIODE = smd 1.1 x 1.1: 1 -1.45,0; 2 1.45,0
MAX7219EWGT = smd 1.27 x 0.9: 1 -4.76,6.985; 2 -4.76,5.715; 3 -4.76,4.445; 4 -4.76,3.175; 5 -4.76,1.905; 6 -4.76,0.635; 7 -4.76,-0.635; 8 -4.76,-1.905; 9 -4.76,-3.175; 10 -4.76,-4.445; 11 -4.76,-5.715; 12 -4.76,-6.985; 13 4.76,-6.985; 14 4.76,-5.715; 15 4.76,-4.445; 16 4.76,-3.175; 17 4.76,-1.905; 18 4.76,-0.635; 19 4.76,0.635; 20 4.76,1.905; 21 4.76,3.175; 22 4.76,4.445; 23 4.76,5.715; 24 4.76,6.985
1X03 = drill 1.016 long: 1 -2.54,0; 2 0,0; 3 2.54,0
WL-SMCW-LED(BLUE) = smd 0.8 x 0.8: 1 -0.8,0; 2 0.8,0
SOIC16N = smd 0.6 x 2.2: 1 -4.445,-2.6; 2 -3.175,-2.6; 3 -1.905,-2.6; 4 -0.635,-2.6; 5 0.635,-2.6; 6 1.905,-2.6; 7 3.175,-2.6; 8 4.445,-2.6; 9 4.445,2.6; 10 3.175,2.6; 11 1.905,2.6; 12 0.635,2.6; 13 -0.635,2.6; 14 -1.905,2.6; 15 -3.175,2.6; 16 -4.445,2.6
BC848-NPN = smd 0.6 x 0.8: 1 -0.65,-0.8; 2 0.65,-0.8; 3 0,0.8
R0603 = smd 1 x 1.1: 1 -0.85,0; 2 0.85,0
PTS647-TACTSWITCH = smd 1.55 x 1: 1 -2.625,1.6; 2 2.625,1.6; 3 -2.625,-1.6; 4 2.625,-1.6
1X02 = drill 1.016 long: 1 -1.27,0; 2 1.27,0

### Placement (x,y rotation side)
B1  98.8,33.4 180 top
BL1  82.2,53.45 0 top
BL2  98.2,53.45 0 top
BL3  113.2,53.45 0 top
BL4  82.2,37.17 180 top
BL5  98.2,37.17 180 top
BL6  113.2,37.17 180 top
BL7  82.2,20.9 180 top
BL8  98.2,20.9 0 top
BL9  113.2,20.9 0 top
C1  23.2,57.5 0 top
C2  43.2,57.5 0 top
C3  63.4,57.5 0 top
C4  23.2,37.5 0 top
C5  43.2,37.5 0 top
C6  63.2,37.5 0 top
C7  23.2,17.5 0 top
C8  43.2,17.5 0 top
C9  63.2,17.5 0 top
C10  147.4,57.5 0 top
C11  167.4,57.5 0 top
C12  187.4,57.5 0 top
C13  147.4,37.5 0 top
C14  167.4,37.5 0 top
C15  187.4,37.5 0 top
C16  147.4,17.5 0 top
C17  167.4,17.5 0 top
C18  187.4,17.5 0 top
C19  118.2,28.2 270 bottom
C20  149.5,51.8 180 bottom
C21  47,39.4 180 bottom
C22  94.6,65.7 0 top
D1  23.2,52.4 180 top
D2  43.2,52.4 180 top
D3  63.4,52.4 180 top
D4  23.2,32.4 180 top
D5  43.2,32.4 180 top
D6  63.2,32.4 180 top
D7  23.2,12.4 180 top
D8  43.2,12.4 180 top
D9  63.2,12.4 180 top
D10  147.4,52.4 180 top
D11  167.4,52.4 180 top
D12  187.4,52.4 180 top
D13  147.4,32.4 180 top
D14  167.4,32.4 180 top
D15  187.4,32.4 180 top
D16  147.4,12.4 180 top
D17  167.4,12.4 180 top
D18  187.4,12.4 180 top
DRIVER1  105.6,29.5 180 bottom
JP1  90.7,61.3 180 top
L1  16.8,61.5 180 top
L2  36.8,61.5 0 top
L3  56.8,61.5 180 top
L4  16.8,41.5 0 top
L5  36.8,41.5 180 top
L6  56.8,41.5 0 top
L7  16.8,21.5 0 top
L8  36.8,21.5 0 top
L9  56.8,21.5 0 top
L10  141,61.5 0 top
L11  161,61.5 180 top
L12  181,61.5 0 top
L13  141,41.5 0 top
L14  161,41.5 0 top
L15  181,41.5 180 top
L16  141,21.5 0 top
L17  161,21.5 0 top
L18  181,21.5 0 top
L19  59,67 90 top
L20  136,67 270 top
MULT1  152.5,45.6 270 bottom
MUX/DEMUX1  45.1,45.6 90 bottom
NPN1  10.9,55.7 0 top
NPN2  30.9,55.7 0 top
NPN3  50.9,55.7 0 top
NPN4  10.9,35.7 0 top
NPN5  30.9,35.7 0 top
NPN6  50.9,35.7 0 top
NPN7  10.9,15.7 0 top
NPN8  30.9,15.7 0 top
NPN9  50.9,15.7 0 top
NPN10  135.1,55.7 0 top
NPN11  155.1,55.7 0 top
NPN12  175.1,55.7 0 top
NPN13  135.1,35.7 0 top
NPN14  155.1,35.7 0 top
NPN15  175.1,35.7 0 top
NPN16  135.1,15.7 0 top
NPN17  155.1,15.7 0 top
NPN18  175.1,15.7 0 top
R1  14.8,52.4 0 top
R2  18.9,52.4 0 top
R3  23.2,54.8 0 top
R4  10.9,52.4 180 top
R5  10.9,59.2 0 top
R6  35,52.4 0 top
R7  38.9,52.4 0 top
R8  43.2,54.8 0 top
R9  30.9,52.4 180 top
R10  30.9,59.2 0 top
R11  55,52.4 0 top
R12  59.1,52.4 0 top
R13  63.4,54.8 0 top
R14  50.9,52.4 180 top
R15  50.9,59.2 0 top
R16  14.8,32.4 0 top
R17  18.9,32.4 0 top
R18  23.2,34.8 0 top
R19  10.9,32.4 180 top
R20  10.9,39.2 0 top
R21  34.8,32.4 0 top
R22  38.9,32.4 0 top
R23  43.2,34.8 0 top
R24  30.9,32.4 180 top
R25  30.9,39.2 0 top
R26  54.8,32.4 0 top
R27  58.9,32.4 0 top
R28  63.2,34.8 0 top
R29  50.9,32.4 180 top
R30  50.9,39.2 0 top
R31  14.8,12.4 0 top
R32  18.9,12.4 0 top
R33  23.2,14.8 0 top
R34  10.9,12.4 180 top
R35  10.9,19.2 0 top
R36  34.8,12.4 0 top
R37  38.9,12.4 0 top
R38  43.2,14.8 0 top
R39  30.9,12.4 180 top
R40  30.9,19.2 0 top
R41  54.8,12.4 0 top
R42  58.9,12.4 0 top
R43  63.1,14.8 0 top
R44  50.9,12.4 180 top
R45  50.9,19.2 0 top
R46  139,52.4 0 top
R47  143.1,52.4 0 top
R48  147.4,54.8 0 top
R49  135.1,52.4 180 top
R50  135.1,59.2 0 top
R51  159,52.4 0 top
R52  163.1,52.4 0 top
R53  167.4,54.8 0 top
R54  155.1,52.4 180 top
R55  155.1,59.2 0 top
R56  179,52.4 0 top
R57  183.1,52.4 0 top
R58  187.4,54.8 0 top
R59  175.1,52.4 180 top
R60  175.1,59.2 0 top
R61  139,32.4 0 top
R62  143.1,32.4 0 top
R63  147.4,34.8 0 top
R64  135.1,32.4 180 top
R65  135.1,39.2 0 top
R66  159,32.4 0 top
R67  163.1,32.4 0 top
R68  167.4,34.8 0 top
R69  155.1,32.4 180 top
R70  155.1,39.2 0 top
R71  179,32.4 0 top
R72  183.1,32.4 0 top
R73  187.4,34.8 0 top
R74  175.1,32.4 180 top
R75  175.1,39.2 0 top
R76  139,12.4 0 top
R77  143.1,12.4 0 top
R78  147.4,14.8 0 top
R79  135.1,12.4 180 top
R80  135.1,19.2 0 top
R81  159,12.4 0 top
R82  163.1,12.4 0 top
R83  167.4,14.8 0 top
R84  155.1,12.4 180 top
R85  155.1,19.2 0 top
R86  179,12.4 0 top
R87  183.1,12.4 0 top
R88  187.4,14.8 0 top
R89  175.1,12.4 180 top
R90  175.1,19.2 0 top
R91  61,67 270 top
R92  134,67 90 top
R93  106.23,61.4 180 top
S1  16.8,58 0 top
S2  36.8,58 0 top
S3  56.8,58 0 top
S4  16.8,38 0 top
S5  36.8,38 0 top
S6  56.8,38 0 top
S7  16.8,18 0 top
S8  36.8,18 0 top
S9  56.8,18 0 top
S10  141,58 0 top
S11  161,58 0 top
S12  181,58 0 top
S13  141,38 0 top
S14  161,38 0 top
S15  181,38 0 top
S16  141,18 0 top
S17  161,18 0 top
S18  181,18 0 top
SL2  99.4,61.3 180 top

### Tracks (layer width: path | path; a pad name or v marks a point on that pad's centre or on a via)
ARD-5V
  Top 0.6: B1.5V 76.59,34.67 77.36,35.43 77.36,56.36 79.7,58.7 87.26,58.7 88.16,59.6 JP1.3
BAT
  Top 0.6: JP1.1 93.24,65.65 C22.1
  Bottom 0.6: SL2.1 100.67,62.73 99.8,63.6 93.8,63.6 93.24,63.04 JP1.1
COL1-1  (via drill 0.35)
  Top 0.2: S7.1 v16.8,19.6 S7.2 | S4.1 v16.8,39.6 S4.2 | S1.1 v16.8,59.6 S1.2 18.52,59.6 16.6,57.67 v16.6,55.4
  Bottom 0.2: v16.8,59.6 20.5,63.3 65,63.3 70.74,57.56 123.85,57.56 135.81,45.6 152.6,45.6 153.24,46.23 MULT1.4 | v16.6,55.4 16.6,39.8 v16.8,39.6 v16.8,19.6
COL1-2  (via drill 0.35)
  Top 0.2: S10.1 v141,59.6 S10.2 | S13.1 v141,39.6 S13.2 | S16.1 v141,19.6 S16.2
  Bottom 0.2: v141,39.6 141,27 138.9,24.9 138.9,21.7 v141,19.6 160.08,19.6 161.93,17.75 184.03,17.75 190.35,24.07 190.35,26.57 188.1,28.82 188.1,60.2 186.6,61.7 141.1,61.7 141,61.6 v141,59.6 142.2,58.4 149.5,58.4 151.8,56.1 151.8,49.8 150.78,48.77 MULT1.15
COL2-1  (via drill 0.35)
  Top 0.2: S2.1 v36.8,59.6 S2.2 | v34.1,38.2 34.1,39.52 | S5.1 S5.2 | v36.8,19.6 S8.2
  Top 0.4: 34.1,39.52 S5.1
  Top 0.6: S8.1 v36.8,19.6
  Bottom 0.2: v36.8,19.6 33.2,23.2 33.2,37.3 v34.1,38.2 34.1,42 26.3,49.8 24.2,49.8 23.5,50.5 23.5,53.68 27.37,57.55 34.75,57.55 v36.8,59.6 17.92,59.6 17.17,58.85 16.43,58.85 16.05,59.23 16.05,60.07 19.83,63.85 65.23,63.85 70.97,58.11 124.18,58.11 135.38,46.9 151.9,46.9 152.5,47.51 MULT1.3
COL2-2  (via drill 0.35)
  Top 0.2: S11.1 v161,59.6 S11.2 | S14.1 v161,39.6 S14.2 | S17.1 v161,19.6 S17.2
  Bottom 0.2: v161,39.6 v161,19.6 162.2,18.4 183.6,18.4 189.5,24.3 189.5,26.3 187.4,28.4 187.4,54.62 181.77,60.25 180.33,60.25 179.68,59.6 v161,59.6 161,52.6 156.55,48.15 152.25,48.15 151.6,47.51 MULT1.14
COL3-1  (via drill 0.35)
  Top 0.2: S9.1 v56.8,19.6 S9.2 | S3.1 v56.8,59.6 S3.2 | S6.2 v56.8,39.6 S6.1
  Bottom 0.2: v56.8,59.6 54.2,57 27.8,57 24.1,53.3 24.1,50.68 24.43,50.35 26.85,50.35 35.2,42 35.2,35.4 42.2,28.4 45.6,28.4 48.5,31.3 48.5,37.57 51.63,40.7 55.7,40.7 v56.8,39.6 v56.8,19.6 55.85,18.65 36.43,18.65 32.55,22.53 32.55,40.58 15.4,57.73 15.4,60.2 19.6,64.4 65.46,64.4 71.2,58.66 124.44,58.66 134.97,48.12 151.4,48.12 152.05,48.77 MULT1.2
COL3-2  (via drill 0.35)
  Top 0.2: S12.1 v181,59.6 S12.2 | S15.1 v181,39.6 S15.2 | S18.1 v181,19.6 S18.2
  Bottom 0.2: v181,39.6 182.8,37.8 182.8,21.4 v181,19.6 | MULT1.13 152.24,46.23 152.9,46.9 171.8,46.9 179.1,39.6 v181,39.6 | v181,59.6 v181,39.6
COLS
  Bottom 0.2: B1.D6 122.93,24.53 120.54,26.92 120.54,54.91 121.94,56.31 124.22,56.31 136.23,44.3 147.3,44.3 147.4,44.3 153,44.3 153.66,44.97 MULT1.5
GND  (via drill 0.35)
  other vias: 8,68 20,68 32,68 44,68 2,59 2,47 2,35 2,23 2,11 22,2 40,2 52,2 26,20 46,20 48.2,15.7 62,26 46,26 24,26 62.7,20.1 25.9,39.8 20.7,46.7 36.4,46.9 26,61.7 48,59 48,55 68,54 68,42 66,48 79,8 111,15 88,34 88.1,24.8 80,50 92.6,46.8 108.4,47.4 80,68 92,68 104,68 116,68 152,66 164,66 176,66 188,66 198,59 198,47 198,35 198,23 198,11 192,4 180,4 174,48 180,46.6 160,44.8 167.2,44.7 170,40 144,26 150,24 156,26 166,26 172.7,24 178,26 128,44 128,38 128,26 130,20 128,14 140,4 155,4 168,4 118,18 118,6 106,8 92,8 99.2,26.3 153.2,50.1
  pour Top: -0.1,70.1 200.1,70.1 200.1,-0.1 -0.1,-0.1
  pour Bottom: -0.1,70.1 -0.1,-0.1 200.1,-0.1 200.1,70.1
LOAD
  Bottom 0.2: DRIVER1.12 106.04,36.48 109.18,39.62 115.22,39.62 116.45,40.85 116.45,43.37 117.7,44.62 117.7,51.2 116.39,52.51 110.11,52.51 106.81,55.81 79.56,55.81 75.96,52.22 75.96,11.28 74.67,9.99 B1.A5
MOSI  (via drill 0.35)
  Top 0.2: B1.D12 122.93,41.32 122.53,41.72 120.21,41.72 v119.89,41.4
  Bottom 0.2: 100.94,22.52 102.44,21.02 118.14,21.02 119.9,22.77 119.89,22.79 v119.89,41.4
  Bottom 0.4: 100.94,22.52 DRIVER1.1
N$1
  Top 0.2: S1.3 14.18,55.08 15.65,53.6 | R1.2 15.65,53.6 | S1.4 19.43,53.8 | 19.43,53.8 19.43,52.73 | R2.2 D1.2 | 15.65,53.6 15.85,53.8 19.43,53.8
  Top 0.4: 19.43,52.73 R2.2
N$2
  Top 0.2: R4.1 11.75,51.66 13.4,50 18,50 | 18,50 21.4,50 23.2,51.8 23.2,53 22.6,53.6 22.6,54.55 R3.1 22.39,54.84 22.39,57 C1.1 | 18,50 18.05,50.05 R2.1
N$3
  Top 0.2: NPN1.1 10.25,52.6
  Top 0.4: 10.25,52.6 R4.2
N$4
  Top 0.2: S2.3 34.17,55.17 35.85,53.5 R6.2 35.85,51.15 36.2,50.8 39.4,50.8 39.75,51.15 R7.2 D2.2 | S2.4 39.42,52.73
  Top 0.4: 39.42,52.73 R7.2
N$5
  Top 0.2: R9.1 31.75,51.26 32.7,50.3 42.1,50.3 43.2,51.4 43.2,53.2 42.35,54.05 R8.1 42.19,54.96 42.19,57.2 C2.1 41.84,57.55 38.3,57.55 37.95,57.2 37.95,52.5 R7.1
N$6
  Top 0.2: R5.1 10.05,57.35 NPN1.3
N$7
  Top 0.2: R5.2 11.75,59.24 13.15,60.65 16.45,60.65 17.3,61.5
  Top 0.4: L1.1 17.3,61.5
N$8
  Top 0.2: NPN2.1 30.25,52.6
  Top 0.4: 30.25,52.6 R9.2
N$9
  Top 0.2: S4.3 14.18,34.67 15.65,33.2 R16.2 15.65,31.25 16.3,30.6 19.4,30.6 19.8,31 19.8,32.35 R17.2 D4.2 | S4.4 19.43,32.73
  Top 0.4: 19.43,32.73 R17.2
N$10
  Top 0.2: R10.1 30.05,57.35 NPN2.3
N$11
  Top 0.2: L2.1 35.95,61.45 33.05,61.45 31.75,60.15 R10.2
N$12
  Top 0.2: 21.64,37.25 18.5,37.25 18.2,36.95 18.2,32.55 | C4.1 22.39,37 22.39,34.84 R18.1 22.3,34.75 22.3,33.8 23.2,32.9 23.2,30.7 22.1,29.6 12.9,29.6 11.75,30.75 R19.1
  Top 0.4: C4.1 21.64,37.25 | 18.2,32.55 R17.1
N$13
  Top 0.2: S3.3 54.17,55.17 55.85,53.5 R11.2 55.85,51.55 56.5,50.9 59.3,50.9 60,51.6 60,52.55 59.95,52.6 | S3.4 59.95,55.88 59.95,52.6 | 59.95,52.6 R12.2 D3.2
N$14
  Top 0.2: 62.55,57.04 R13.1 62.55,54.05 63.3,53.3 63.3,51 62.7,50.4 52.2,50.4 51.75,50.85 R14.1 | R12.1 58.05,52.6 58.05,56.99 58.6,57.55 62.04,57.55 C3.1
  Top 0.4: C3.1 62.55,57.04
N$15
  Top 0.2: NPN3.1 50.25,52.6
  Top 0.4: 50.25,52.6 R14.2
N$16
  Top 0.2: R15.1 50.05,57.35 NPN3.3
N$17
  Top 0.2: L3.1 56.75,60.65 52.4,60.65 51.75,60 R15.2
N$18
  Top 0.2: NPN4.1 10.25,32.6
  Top 0.4: 10.25,32.6 R19.2
N$19
  Top 0.2: R20.1 10.05,37.35 NPN4.3
N$20
  Top 0.2: L4.1 15.25,40.75 12.65,40.75 11.75,39.84 R20.2
N$21
  Top 0.2: S5.3 34.17,35.9 35.65,34.42 R21.2 35.65,31.15 35.9,30.9 39.5,30.9 39.8,31.2 39.8,32.35 R22.2 | 39.75,36.08 R22.2 | R22.2 D5.2
  Top 0.4: S5.4 39.75,36.08
N$22
  Top 0.2: R22.1 37.85,32.6 37.85,37.2 38.41,37.75 41.64,37.75 C5.1 41.89,35.26 R23.1 42.35,33.95 43.2,33.1 43.2,30.6 42.8,30.2 33,30.2 31.75,31.45 R24.1
N$23
  Top 0.2: R24.2 30.05,34.7 NPN5.1
N$24
  Top 0.2: R25.1 30.9,38.35 NPN5.3
N$25
  Top 0.2: 32.01,39.2 33.45,40.65 36.75,40.65 L5.1
  Top 0.4: 32.01,39.2 R25.2
N$26
  Top 0.2: S6.3 54.17,35.08 55.65,33.6 R26.2 55.65,31.45 56.3,30.8 59.1,30.8 59.8,31.5 59.8,32.4 | S6.4 59.73,36.1 59.73,32.73 | R27.2 59.8,32.4 | 59.8,32.4 D6.2
  Top 0.4: R27.2 59.75,32.7 59.73,32.73
N$27
  Top 0.2: R27.1 57.75,32.7 57.75,36.99 58.51,37.75 61.64,37.75 C6.1 62.09,37.3 62.09,35.26 62.35,35 R28.1 62.3,34.75 62.3,34 63.2,33.1 63.2,31 62.3,30.1 52.6,30.1 51.75,30.95 R29.1
N$28
  Top 0.2: NPN6.1 50.25,32.6
  Top 0.4: 50.25,32.6 R29.2
N$29
  Top 0.2: R30.1 50.05,37.35 NPN6.3
N$30
  Top 0.2: L6.1 55.95,41.45 53.55,41.45 51.75,39.65 R30.2
N$31
  Top 0.2: S7.3 14.18,14.47 15.65,13 R31.2 15.65,11.35 16.2,10.8 19.5,10.8 19.8,11.1 19.8,12.4 | S7.4 19.43,12.72 R32.2 19.8,12.4 | D7.2 19.8,12.4
N$32
  Top 0.2: R32.1 17.75,12.7 17.75,16.89 18.55,17.7 21.69,17.7 C7.1 22.29,17.1 22.29,14.86 R33.1 22.35,13.65 23.2,12.8 23.2,11.2 22.1,10.1 12.3,10.1 11.75,10.65 R34.1
N$33
  Top 0.2: NPN7.1 10.25,12.6
  Top 0.4: 10.25,12.6 R34.2
N$34
  Top 0.2: R35.1 10.05,18.6 10.9,17.75 NPN7.3
N$35
  Top 0.2: L7.1 15.95,21.55 13.15,21.55 11.75,20.14 R35.2
N$36
  Top 0.2: S8.3 34.17,15.07 35.65,13.6 R36.2 35.65,11.75 36.3,11.1 39.6,11.1 39.75,11.25 R37.2 D8.2 | S8.4 39.42,12.72
  Top 0.4: 39.42,12.72 R37.2
N$37
  Top 0.2: 38.3,12.65 38.3,17.05 38.51,17.25 41.64,17.25 | 42.35,17.04 R38.1 42.35,13.95 43.3,13 43.3,10.8 43,10.5 32.3,10.5 31.75,11.05 R39.1
  Top 0.4: R37.1 38.3,12.65 | 41.64,17.25 C8.1 42.35,17.04
N$38
  Top 0.2: NPN8.1 30.25,12.6
  Top 0.4: 30.25,12.6 R39.2
N$39
  Top 0.2: R40.1 30.05,17.35 NPN8.3
N$40
  Top 0.2: L8.1 33.05,21.5 31.75,20.2 R40.2
N$41
  Top 0.2: S9.3 54.17,13.88 R41.2 55.65,11.45 56.2,10.9 59.2,10.9 59.8,11.5 59.8,12.4 | S9.4 59.42,12.72 | R42.2 59.8,12.4 | 59.8,12.4 D9.2
  Top 0.4: 59.42,12.72 R42.2
N$42
  Top 0.2: R42.1 57.85,12.6 57.85,17.3 58.41,17.85 61.54,17.85 C9.1 62.19,17.2 62.19,14.86 R43.1 62.25,13.75 63.2,12.8 63.2,11.2 62.3,10.3 52.4,10.3 51.75,10.95 R44.1
N$43
  Top 0.2: NPN9.1 50.25,12.6
  Top 0.4: 50.25,12.6 R44.2
N$44
  Top 0.2: R45.1 50.05,17.35 NPN9.3
N$45
  Top 0.2: L9.1 53.05,21.5 51.75,20.2 R45.2
N$46
  Top 0.2: S10.3 138.38,55.12 139.85,53.65 R46.2 139.85,51.25 140.6,50.5 143.6,50.5 144,50.9 144,52.4 | 144,52.4 R47.2 143.95,56.08 | 144,52.4 D10.2
  Top 0.4: S10.4 143.95,56.08
N$47
  Top 0.2: 146.09,57.4 146.39,57.1 146.39,54.96 R48.1 146.55,53.95 147.4,53.1 147.4,49.4 146.8,48.8 137.1,48.8 135.95,49.95 R49.1 | C10.1 145.84,57.75 142.71,57.75 141.95,56.99 141.95,52.7 R47.1
  Top 0.4: 146.09,57.4 C10.1
N$48
  Top 0.2: NPN10.1 134.45,52.6
  Top 0.4: 134.45,52.6 R49.2
N$49
  Top 0.2: R50.1 134.25,57.25 135,56.5
  Top 0.4: 135,56.5 NPN10.3
N$50
  Top 0.2: R50.2 138.25,61.5 L10.1
N$51
  Top 0.2: S11.3 158.38,53.88 R51.2 159.85,51.55 160.7,50.7 163.5,50.7 164,51.2 164,52.35 R52.2 | S11.4 163.62,52.73 163.78,52.58 R52.2 | R52.2 D11.2
N$52
  Top 0.2: 166.47,54.88 166.47,57.12 C11.1 165.79,57.8 162.7,57.8 162.05,57.15 162.05,52.6 R52.1 | 166.47,54.88 166.28,55.08 166.28,54.12 167.4,53 167.4,50.9 166.5,50 156.7,50 155.95,50.75 R54.1 | 166.47,54.88 R53.1
N$53
  Top 0.2: NPN11.1 154.45,52.6 R54.2
N$54
  Top 0.2: R55.1 154.25,57.35 NPN11.3
N$55
  Top 0.2: L11.1 161.8,61 161.4,60.6 156.8,60.6 155.95,59.75 R55.2
N$56
  Top 0.2: S12.3 178.38,54.67 179.85,53.2 R56.2 179.85,51.15 180.3,50.7 183.5,50.7 184,51.2 184,52.35 R57.2 | S12.4 183.62,52.73 R57.2 | R57.2 D12.2
N$57
  Top 0.2: R57.1 181.95,52.7 181.95,56.99 182.71,57.75 185.84,57.75 C12.1 186.09,55.26 R58.1 186.55,53.95 187.5,53 187.5,51.1 186.5,50.1 176.5,50.1 175.95,50.65 R59.1
N$58
  Top 0.2: NPN12.1 174.45,52.6 R59.2
N$59
  Top 0.2: R60.1 174.25,57.25 175,56.5 NPN12.3
N$60
  Top 0.2: L12.1 178,61.5 175.95,59.45 R60.2
N$61
  Top 0.2: S13.4 143.62,32.73 R62.2 D13.2 145.95,31.05 145,30.1 140.5,30.1 139.85,30.75 R61.2 139.85,33.9 138.38,35.38 S13.3
N$62
  Top 0.2: R62.1 141.95,32.7 141.95,37.2 142.6,37.85 145.74,37.85 C13.1 146.55,37.04 146.55,34.9 R63.1 146.55,33.95 147.5,33 147.5,29.6 146.9,29 136.6,29 135.95,29.65 R64.1
N$63
  Top 0.2: NPN13.1 134.45,32.6
  Top 0.4: 134.45,32.6 R64.2
N$64
  Top 0.2: R65.1 134.25,38 135.1,37.15 NPN13.3
N$65
  Top 0.2: L13.1 140.15,41.55 136.85,41.55 135.95,40.65 R65.2
N$66
  Top 0.2: S14.3 158.38,33.88 R66.2 159.85,31.25 160.5,30.6 165.6,30.6 166,31 166,32.35 D14.2 R67.2 163.62,32.73 S14.4
N$67
  Top 0.2: R67.1 161.95,32.7 161.95,36.49 163.31,37.85 165.74,37.85 C14.1 166.49,37.1 166.49,34.86 R68.1 166.55,33.95 167.3,33.2 167.3,30.8 166.2,29.7 156.7,29.7 155.95,30.45 R69.1
N$68
  Top 0.2: NPN14.1 154.45,32.6 R69.2
N$69
  Top 0.2: R70.1 154.25,37.35 NPN14.3
N$70
  Top 0.2: L14.1 160.15,41.45 157.35,41.45 155.95,40.05 R70.2
N$71
  Top 0.2: S15.3 178.38,33.88 R71.2 179.85,31.25 180.3,30.8 183.7,30.8 184,31.1 184,32.4 | S15.4 183.62,32.73 R72.2 184,32.4 | 184,32.4 D15.2
N$72
  Top 0.2: 186.49,34.86 186.49,37.1 C15.1 185.64,37.95 183.41,37.95 181.85,36.4 181.85,32.8 R72.1 | 186.49,34.86 R73.1 | R74.1 175.95,30.35 176.5,29.8 187.1,29.8 187.5,30.2 187.5,33.2 186.49,34.21 186.49,34.86
N$73
  Top 0.2: NPN15.1 174.45,32.6 R74.2
N$74
  Top 0.2: R75.1 174.25,38 175.1,37.15 NPN15.3
N$75
  Top 0.2: L15.1 181.8,41.1 181.4,40.7 176.9,40.7 175.95,39.75 R75.2
N$76
  Top 0.2: S16.3 138.38,15.5 139.97,13.9 139.97,12.53 R76.2 139.85,10.65 140.4,10.1 143.7,10.1 144,10.4 144,12.4 | S16.4 143.62,12.72 R77.2 144,12.4 | 144,12.4 D16.2
N$77
  Top 0.2: R77.1 142.25,12.6 141.95,12.3 141.95,17.2 142.71,17.95 145.64,17.95 C16.1 146.09,15.26 146.28,15.07 | 146.28,15.07 R78.1 | R79.1 135.95,9.65 136.7,8.9 146.5,8.9 147.3,9.7 147.3,13.4 146.28,14.43 146.28,15.07
N$78
  Top 0.2: NPN16.1 134.45,12.6 R79.2
N$79
  Top 0.2: R80.1 134.25,17.85 135.1,17 NPN16.3
N$80
  Top 0.2: L16.1 139.45,20.75 136.56,20.75 135.95,20.14 R80.2
N$81
  Top 0.2: S17.3 158.38,13.88 R81.2 159.85,11.15 160.4,10.6 163.6,10.6 164.1,11.1 164.1,12.3 164,12.4 | S17.4 163.95,16.07 R82.2 164,12.4 | 164,12.4 D17.2
N$82
  Top 0.2: R82.1 162.25,17.3 162.91,17.95 165.64,17.95 C17.1 166.55,17.04 R83.1 166.55,14.05 167.4,13.2 167.4,10.5 166.5,9.6 156.6,9.6 155.95,10.25 R84.1
N$83
  Top 0.2: NPN17.1 154.45,12.6 R84.2
N$84
  Top 0.2: R85.1 155.1,18.35 NPN17.3
N$85
  Top 0.2: L17.1 159.15,20.45 157.46,20.45 156.21,19.2 R85.2
N$86
  Top 0.2: S18.3 178.38,15.8 179.85,14.32 R86.2 179.85,11.05 180.4,10.5 183.7,10.5 184,10.8 184,12.35 R87.2 | S18.4 183.62,12.72 R87.2 | R87.2 D18.2
N$87
  Top 0.2: R87.1 181.95,12.7 181.95,17.2 182.6,17.85 185.74,17.85 C18.1 186.55,17.04 R88.1 186.55,13.95 187.4,13.1 187.4,10.2 187,9.8 176.6,9.8 175.95,10.45 R89.1
N$88
  Top 0.2: NPN18.1 174.45,12.6 R89.2
N$89
  Top 0.2: R90.1 174.25,18.5 175.1,17.65 NPN18.3
N$90
  Top 0.2: L18.1 179.7,21.5 178.85,20.65 176.85,20.65 175.95,19.75 R90.2
N$91  (via drill 0.35)
  Top 0.2: R93.1 108.3,60.18 v108.3,55.9
  Bottom 0.2: v108.3,55.9 108.9,55.3 114.73,55.3 118.31,51.71 118.31,33.71 114.73,30.14 DRIVER1.18
N$92
  Top 0.2: L19.1 60.95,66.2 R91.2
N$94
  Top 0.2: L20.1 134.05,67.8 R92.2
OUT-COL1-G  (via drill 0.35)
  Top 0.2: v84.1,52 83.12,52.98 BL1.4 | v83.14,38.96 82.14,38.96 81.3,38.13 BL4.4 | BL7.4 81.5,21.38 83.15,23.02 83.15,35.2 v82.95,35.4 | v104.2,37.65 v104.2,35.4
  Bottom 0.2: v84.1,52 84.1,39.93 v83.14,38.96 84.1,38 91.75,38 95,41.25 100.6,41.25 v104.2,37.65 | 83.2,38.9 83.2,38 82.95,37.75 v82.95,35.4 | v104.2,35.4 106.92,32.67 DRIVER1.16
  Bottom 0.4: v83.14,38.96 83.2,38.9
OUT-COL1-R  (via drill 0.35)
  Top 0.2: BL7.1 80.45,20.43 80.05,20.83 80.05,21.92 81.3,23.17 BL4.1 80.86,36.7 80.35,37.2 80.35,38.59 85.05,43.3 | BL1.1 84.75,53.92 85.05,53.62 85.05,43.3 | 85.05,43.3 85.05,40.5 86.15,39.4 109.25,39.4 v109.7,38.95
  Bottom 0.2: DRIVER1.14 109.89,35.69 109.58,35.69 109.17,36.09 109.17,37.08 109.7,37.6 v109.7,38.95
OUT-COL2-G  (via drill 0.35)
  Top 0.2: BL8.4 99.28,20.43 99.88,19.82 100.3,19.82 v100.4,19.93 | v96.2,38.05 96.2,37.8 96.35,37.65 BL5.4 | BL2.4 99.1,41.2 v98.1,40.2 | v108.6,22.4 108.6,21.9 v107.1,20.4
  Bottom 0.2: v100.4,19.93 100.53,19.93 100.9,20.3 | 100.9,20.3 100.9,20.88 94.35,27.43 94.35,39.82 95.23,40.7 95.77,40.7 96.2,40.27 96.2,40.2 | 96.2,40.2 v96.2,38.05 | v98.1,40.2 96.2,40.2 | v107.1,20.4 107,20.3 100.9,20.3 | v108.6,22.4 109.98,23.79 DRIVER1.23
OUT-COL2-R  (via drill 0.35)
  Top 0.2: BL5.1 97.3,36.6 | 97.3,36.6 97.3,23.18 BL8.1 | 97.3,36.6 98.3,35.6 98.97,35.6 107.07,27.5 v108.7,27.5 | BL2.1 99.84,53.92 100.05,53.72 100.05,52.53 99.9,52.38 v99.9,40.4 | v95.99,37.09 95.99,36.81 96.2,36.6 97.3,36.6
  Bottom 0.2: v108.7,27.5 110.27,27.5 DRIVER1.20 | v99.9,40.4 96.59,37.09 v95.99,37.09
OUT-COL3-G  (via drill 0.35)
  Top 0.2: BL3.4 114.1,39.34 115.25,38.2 115.25,20.93 114.75,20.43 BL9.4 114.2,20.32 114.2,19.8 114.6,19.4 115.6,19.4 115.95,19.75 115.95,32.15 115.9,32.2 v115.9,32.5 | BL6.4 109.75,37.65 108.8,36.7 v108.8,35
  Bottom 0.2: v115.9,32.5 114.45,33.95 DRIVER1.15 109.86,33.95 v108.8,35
OUT-COL3-R  (via drill 0.35)
  Top 0.2: BL6.1 112.3,23.27 114.1,21.48 | BL3.1 114.4,53.62 114.84,53.62 116.6,51.87 v116.6,27.9 | v114.2,24.1 114.5,23.8 114.5,21.88 114.1,21.48 | 114.1,21.48 BL9.1
  Bottom 0.2: v116.6,27.9 116.6,27.2 115.72,26.32 DRIVER1.21 112.58,26.32 113.8,25.1 113.8,24.5 v114.2,24.1
OUT-ROW1  (via drill 0.35)
  Top 0.2: BL2.2 BL2.3 97.3,41.75 95.5,39.95 v95.5,40.05 | BL1.3 BL1.2 81.3,54.22 81.66,54.58 90.25,54.58 90.89,53.92 BL2.2 | BL3.3 BL3.2 112.3,54.23 111.85,54.67 97.66,54.67 97.3,54.32 BL2.2
  Bottom 0.2: DRIVER1.2 100.37,24.25 99.16,24.25 95.2,28.21 95.2,39.75 v95.5,40.05
OUT-ROW2  (via drill 0.35)
  Top 0.2: BL5.2 BL5.3 | BL6.2 BL6.3 113.45,38.3 99.75,38.3 BL5.3 | BL5.3 99.1,38.24 98.55,38.8 85.25,38.8 84.1,37.65 BL4.3 BL4.2 94.5,36.7 96.6,34.6 v96.6,30.8
  Bottom 0.2: v96.6,30.8 98.53,28.86 DRIVER1.6
OUT-ROW3  (via drill 0.35)
  Top 0.2: BL9.2 BL9.3 112.3,19.9 111.9,19.5 103.17,19.5 | BL7.2 BL7.3 BL8.2 BL8.3 97.3,19.73 97.75,19.27 102.94,19.27 103.17,19.5 | v98.7,34.65 98,33.95 98,24.67 103.17,19.5
  Bottom 0.2: v98.7,34.65 99.27,35.22 DRIVER1.11
ROW1-1  (via drill 0.35)
  Top 0.2: D3.1 64.85,51.51 63.2,49.85 48.76,49.85 46.2,52.4 D2.1 44.65,51.1 43.34,49.8 29.7,49.8 27.11,52.4 D1.1 | 24.8,52.25 v24.8,51
  Top 0.4: D1.1 24.8,52.25
  Bottom 0.2: MUX/DEMUX1.13 45.94,44.97 45.1,45.8 45.1,50.3 44.4,51 v24.8,51
ROW1-2  (via drill 0.35)
  Top 0.2: D10.1 148.85,51.55 150.96,49.45 166.79,49.45 168.85,51.51 D11.1 170.5,52.4 173.35,49.55 186.79,49.55 188.85,51.6 D12.1 189.75,53.3 v190.3,53.3
  Bottom 0.2: v190.3,53.3 190.3,28.68 191.75,27.23 191.75,23.42 174.23,5.9 127.7,5.9 123.6,1.8 72.72,1.8 66.5,8.02 66.5,35.94 59.37,43.08 46.38,43.08 44.45,41.16 MUX/DEMUX1.1
ROW2-1  (via drill 0.35)
  Top 0.2: D6.1 64.65,31.2 62.99,29.55 49.95,29.55 47.1,32.4 D5.1 44.65,31.05 43.25,29.65 30.16,29.65 27.41,32.4 D4.1
  Top 0.4: 44.65,31.05 v44.7,31
  Bottom 0.2: v44.7,31 44.7,37.3 42.8,39.2 40.6,39.2 39.5,40.3 39.5,42.5 40.08,43.08 44.38,43.08 45,43.7 47.1,43.7
  Bottom 0.4: 47.1,43.7 47.2,43.6 47.6,43.6 MUX/DEMUX1.14
ROW2-2  (via drill 0.35)
  Top 0.2: D13.1 148.85,31.45 151.25,29.05 166.69,29.05 168.85,31.2 D14.1 169.96,32.4 173.21,29.15 187.85,29.15 188.9,30.2 v188.9,31.1 188.9,32.35 D15.1 | v57.9,44.5 58.4,45 58.4,45.9 57.6,46.7 v40.2,46.7
  Bottom 0.2: v188.9,31.1 188.9,29 191.1,26.8 191.1,23.74 173.86,6.5 127.4,6.5 123.3,2.4 72.91,2.39 67.05,8.25 67.05,36.17 58.72,44.5 v57.9,44.5 | MUX/DEMUX1.5 40.6,46.23 40.2,46.63 v40.2,46.7
ROW3-1  (via drill 0.35)
  Top 0.2: D7.1 26.3,12.4 28.86,9.85 43.59,9.85 44.65,10.9 D8.1 45.05,12 47.01,12 49.16,9.85 63.25,9.85 64.65,11.25 D9.1
  Top 0.4: 64.65,11.25 v64.7,11.2
  Bottom 0.2: v64.7,11.2 64.7,22.6 65.85,23.75 65.85,35.82 59.24,42.42 MUX/DEMUX1.15
ROW3-2  (via drill 0.35)
  Top 0.2: D18.1 188.85,10.4 187.5,9.05 172.75,9.05 169.41,12.4 D17.1 169,12.25 v169,11.1 169,10.2 167.75,8.95 153.56,8.95 150.1,12.4 D16.1 | v40.6,42.4 42.8,44.6 v56.3,44.6
  Bottom 0.2: v169,11.1 165,7.1 127.1,7.1 123,3 73.1,3 67.6,8.5 67.6,36.4 58.8,45.2 56.9,45.2 v56.3,44.6 | v40.6,42.4 40.62,42.42 MUX/DEMUX1.2
ROWS
  Bottom 0.2: B1.D2 112.16,3.58 73.3,3.58 68.15,8.73 68.15,36.63 58.38,46.4 55.9,46.4 53.8,44.3 44.8,44.3 44.2,43.7 MUX/DEMUX1.3
SCK  (via drill 0.35)
  Top 0.2: v117.7,43.4 117.86,43.56 B1.D13
  Bottom 0.2: v117.7,43.4 117.2,42.9 117.2,37.4 116.28,36.48 DRIVER1.13
SEL_COL-A
  Bottom 0.2: B1.D7 122.92,27.05 121.09,28.88 121.09,54.68 122.17,55.76 123.84,55.76 135.91,43.69 MULT1.11
SEL_COL-B
  Bottom 0.2: B1.D8 122.93,30.88 121.64,32.17 121.64,54.45 122.4,55.21 123.46,55.21 136.25,42.42 MULT1.10
SEL_COL-C
  Top 0.2: B1.D9 123.71,33.4 126.41,36.09 126.56,36.24 126.56,36.26 126.56,36.4 126.56,61.36 125.31,62.6 | R91.1 62.35,67.85 62.9,67.3 62.9,65.4 63.8,64.5 67.6,64.5 72,60.1 84.11,60.1 87.39,63.38 88.55,63.38 89.42,62.51 89.42,59.55 93.82,55.15 109.95,55.15 117.4,62.6 125.31,62.6 | 125.31,62.6 134.6,62.6 136,64 L20.2
  Bottom 0.2: MULT1.9 136.25,41.16 128.5,33.4 B1.D9
SEL_ROW-A
  Bottom 0.2: B1.D3 110.17,4.13 73.53,4.13 68.7,8.96 68.7,36.9 58.09,47.51 MUX/DEMUX1.11
SEL_ROW-B
  Bottom 0.2: B1.D4 108.18,4.68 73.77,4.68 69.25,9.2 69.25,37.18 57.66,48.77 MUX/DEMUX1.10
SEL_ROW-C
  Bottom 0.2: B1.D5 106.22,5.26 73.96,5.26 69.8,9.43 69.8,37.41 57.17,50.05 MUX/DEMUX1.9
VCC  (via drill 0.35)
  Top 0.6: L2.2 37.7,61.6 55.9,61.6 L3.2 56,62.7 57.6,64.3 57.6,66.9 58.5,67.8 L19.2 59,68.5 59.75,69.25 76.6,69.25 81.75,64.1 89.8,64.1 90.7,63.2 JP1.2 90.7,59.8 92.1,58.4 102.38,58.4 R93.2 105.38,63.08 v105.4,63.1 | L2.2 37.6,62.8 36.45,64.1 17.16,64.1 16,62.79 L1.2 9.16,61.5 8.4,60.74 8.4,51.3 17.6,42.1 L4.2 L5.2 36,42 36.6,42.6 v38.3,42.6 38.9,42.6 40.4,41.1 50.3,41.1 50.3,41.2 52.2,43.1 57.2,43.1 57.6,42.7 L6.2 64.5,41.5 70.1,35.9 70.1,29.2 62.4,21.5 L9.2 57.6,22.34 57.04,22.9 37.6,22.9 | 37.6,22.9 L8.2 | 37.6,22.9 18.3,22.9 17.6,22.2 L7.2 | 161.7,43.15 141.75,43.15 | L18.2 181.8,22.64 181.39,23.05 178.51,23.05 176.96,21.5 L17.2 161.8,22.34 160.89,23.25 158.61,23.25 156.86,21.5 L16.2 141.8,23.1 140.3,24.6 134.7,24.6 130.7,28.6 130.7,40.9 132.95,43.15 141.75,43.15 | v38,60.6 37.6,61 L2.2 | L13.2 141.75,41.55 141.75,43.15 | 161.7,43.15 180.2,43.15 | 180.2,43.15 191.65,43.15 192.8,44.3 192.8,59.3 190.6,61.5 L12.2 181.8,63 180.7,64.1 161.2,64.1 160.2,63.1 L11.2 L10.2 v141.8,62.7 | L14.2 161.8,43.05 161.7,43.15 | L15.2 180.2,43.15
  Bottom 0.6: v38.3,42.6 38.3,34.02 42.82,29.5 45,29.5 47.3,31.8 47.3,38.1 47.85,38.65 C21.2 47.85,41.01 MUX/DEMUX1.16 | v38,60.6 66.48,60.6 70.37,56.71 114.64,56.71 119.08,52.27 119.08,29.93 C19.1 118.02,28.86 DRIVER1.19 | 135.16,63.11 141.37,56.9 148.9,56.9 150.35,55.45 C20.2 150.35,50.49 MULT1.16 | 105.5,65.11 92.31,65.11 90.7,63.5 JP1.2 | 105.5,65.11 108.39,65.11 110.39,63.11 135.16,63.11 | v141.8,62.7 141.39,63.11 135.16,63.11 | v105.4,63.1 105.4,65.01 105.5,65.11

### Text on the board
Top: Your / Turn | Your / Turn | RUB / DraKo / TicTacToe_v1 | SE / 30/06/22
tStop: Your / Turn | Your / Turn | RUB / DraKo / TicTacToe_v1 | SE / 30/06/22